# EasyEDA Pro project ProProject_ExtBoard-002_2024-05-18.epro, schematic Schematic-ExtBoard-002

## Sheets
1 USB: Create Date: 2024-04-20; Page Name: USB; Project Name: ExtBoard-002; Schematic Name: Schematic-ExtBoard-002; Update Date: 2024-04-20; Company: 嘉立创EDA; Page Size: A4; Version: V1.0
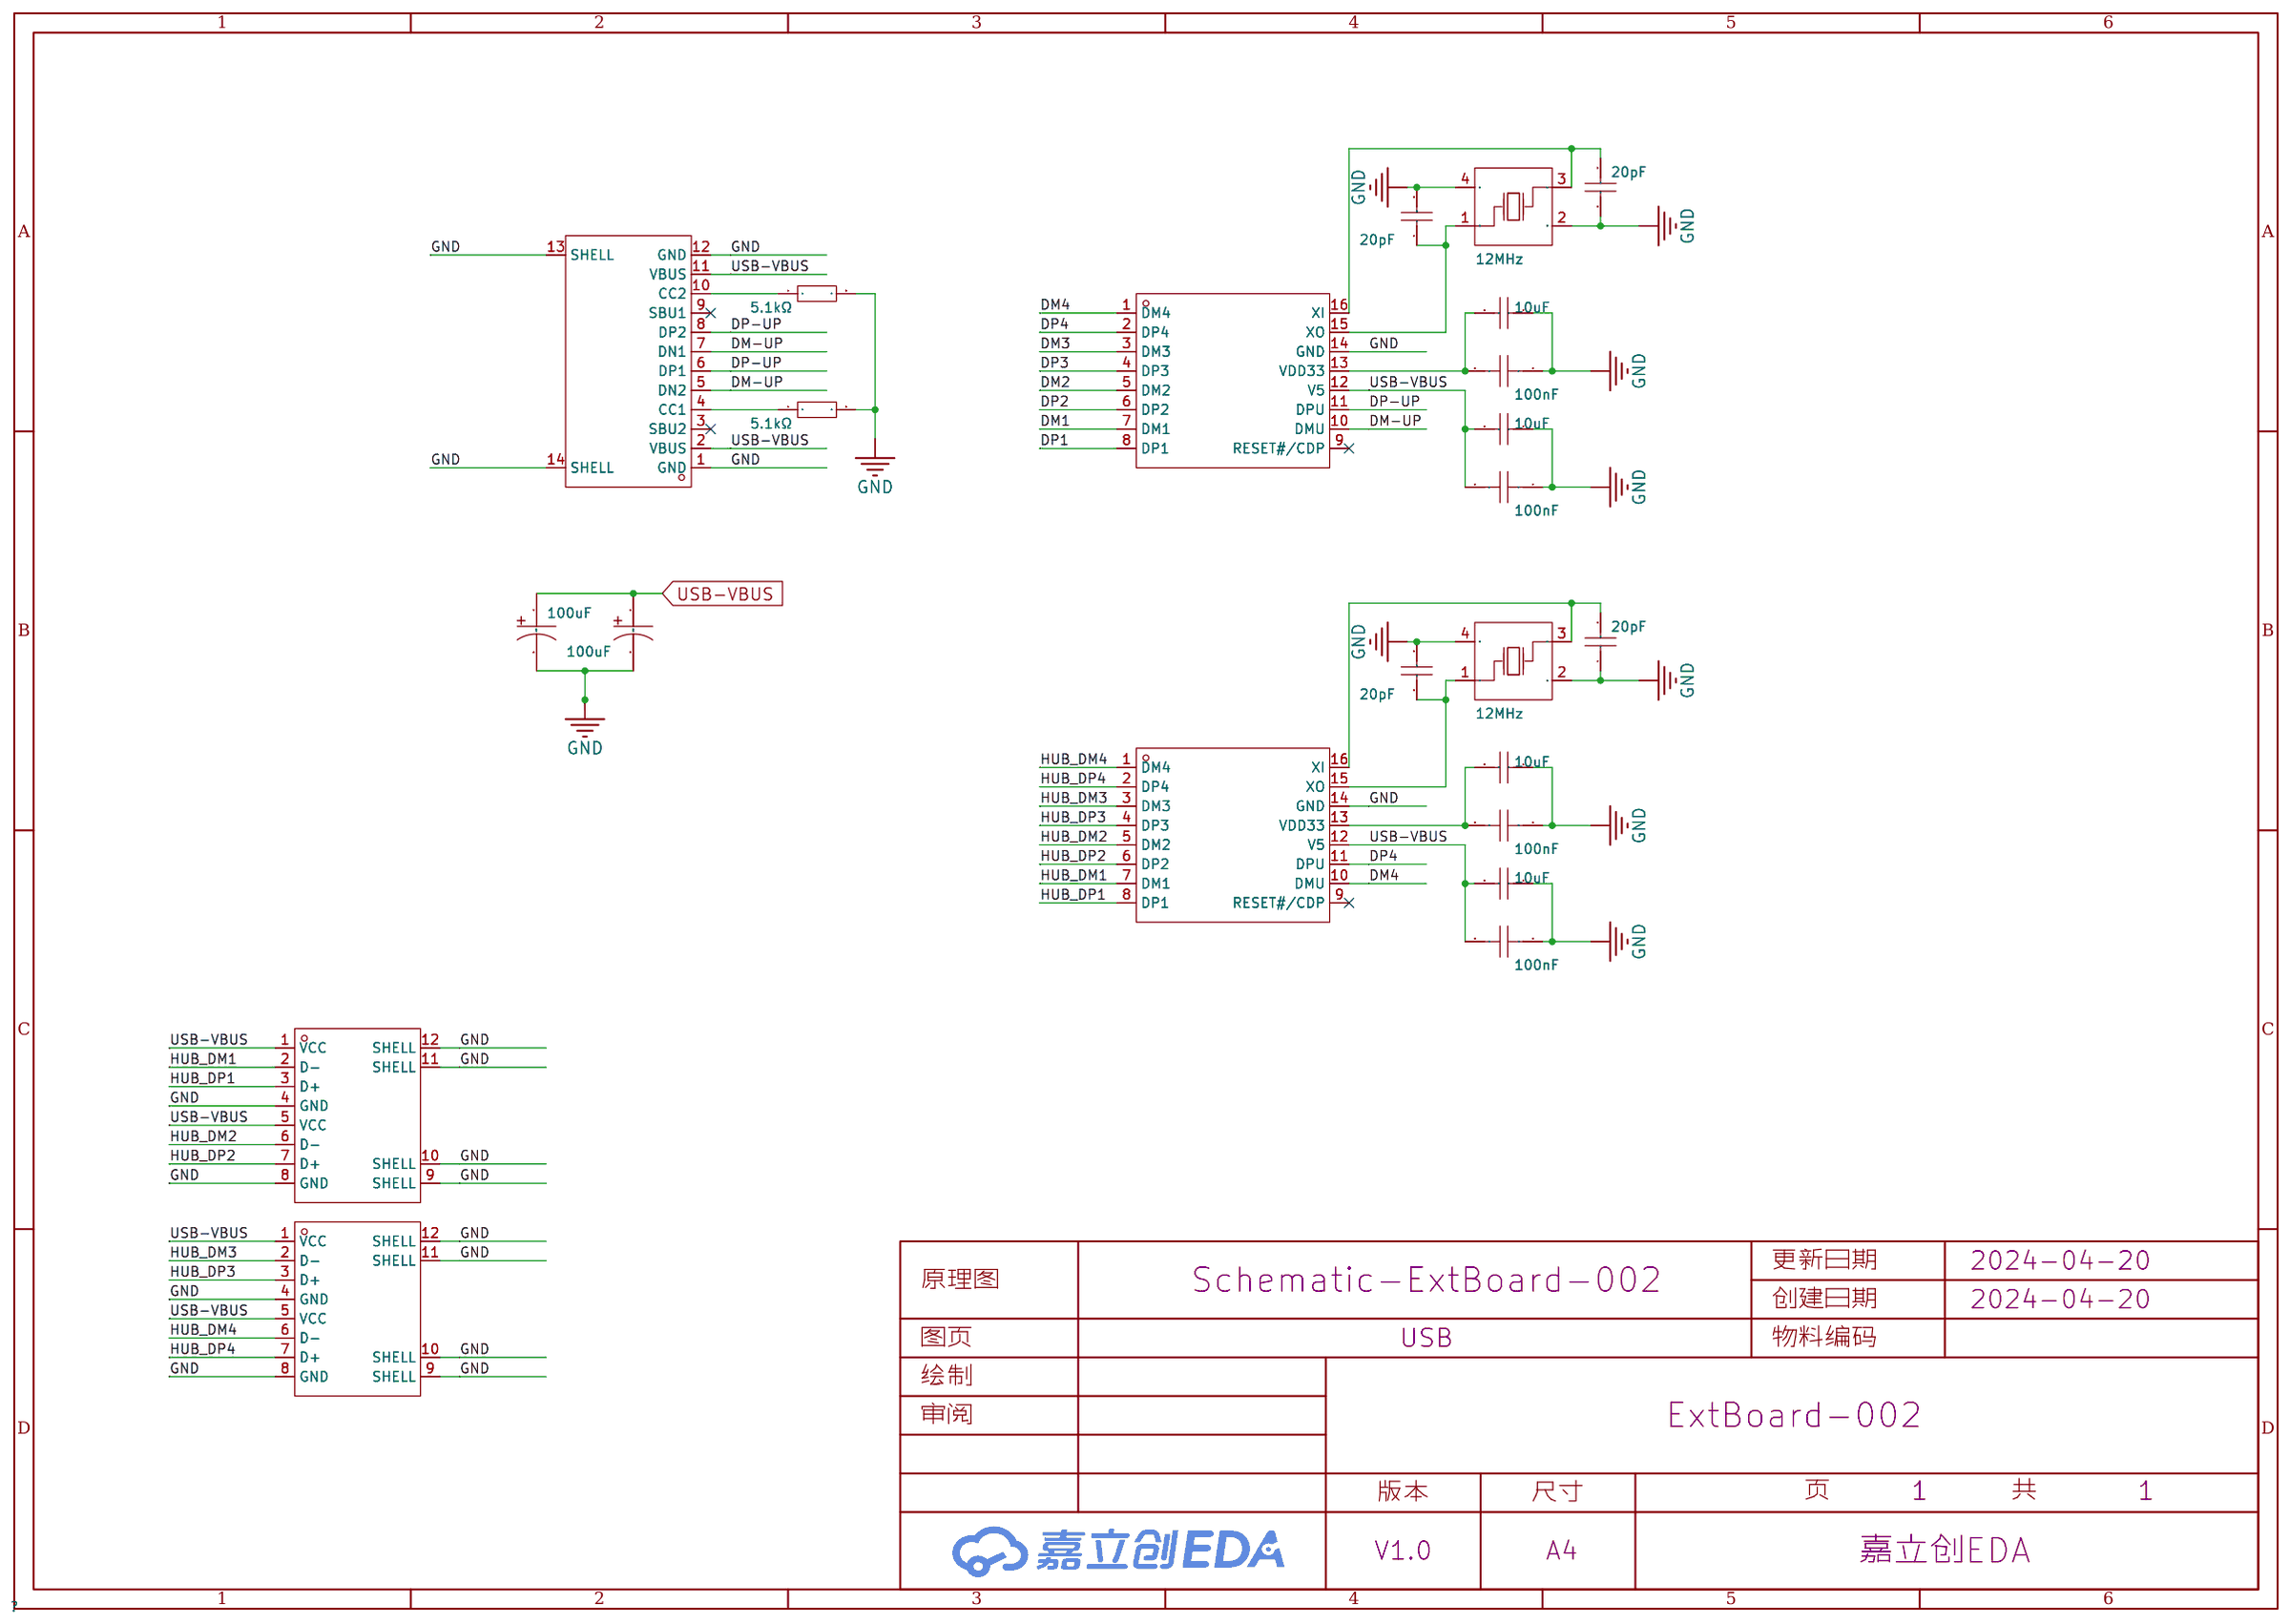
[diagram p0: USB]
2 Power: Page Name: Power
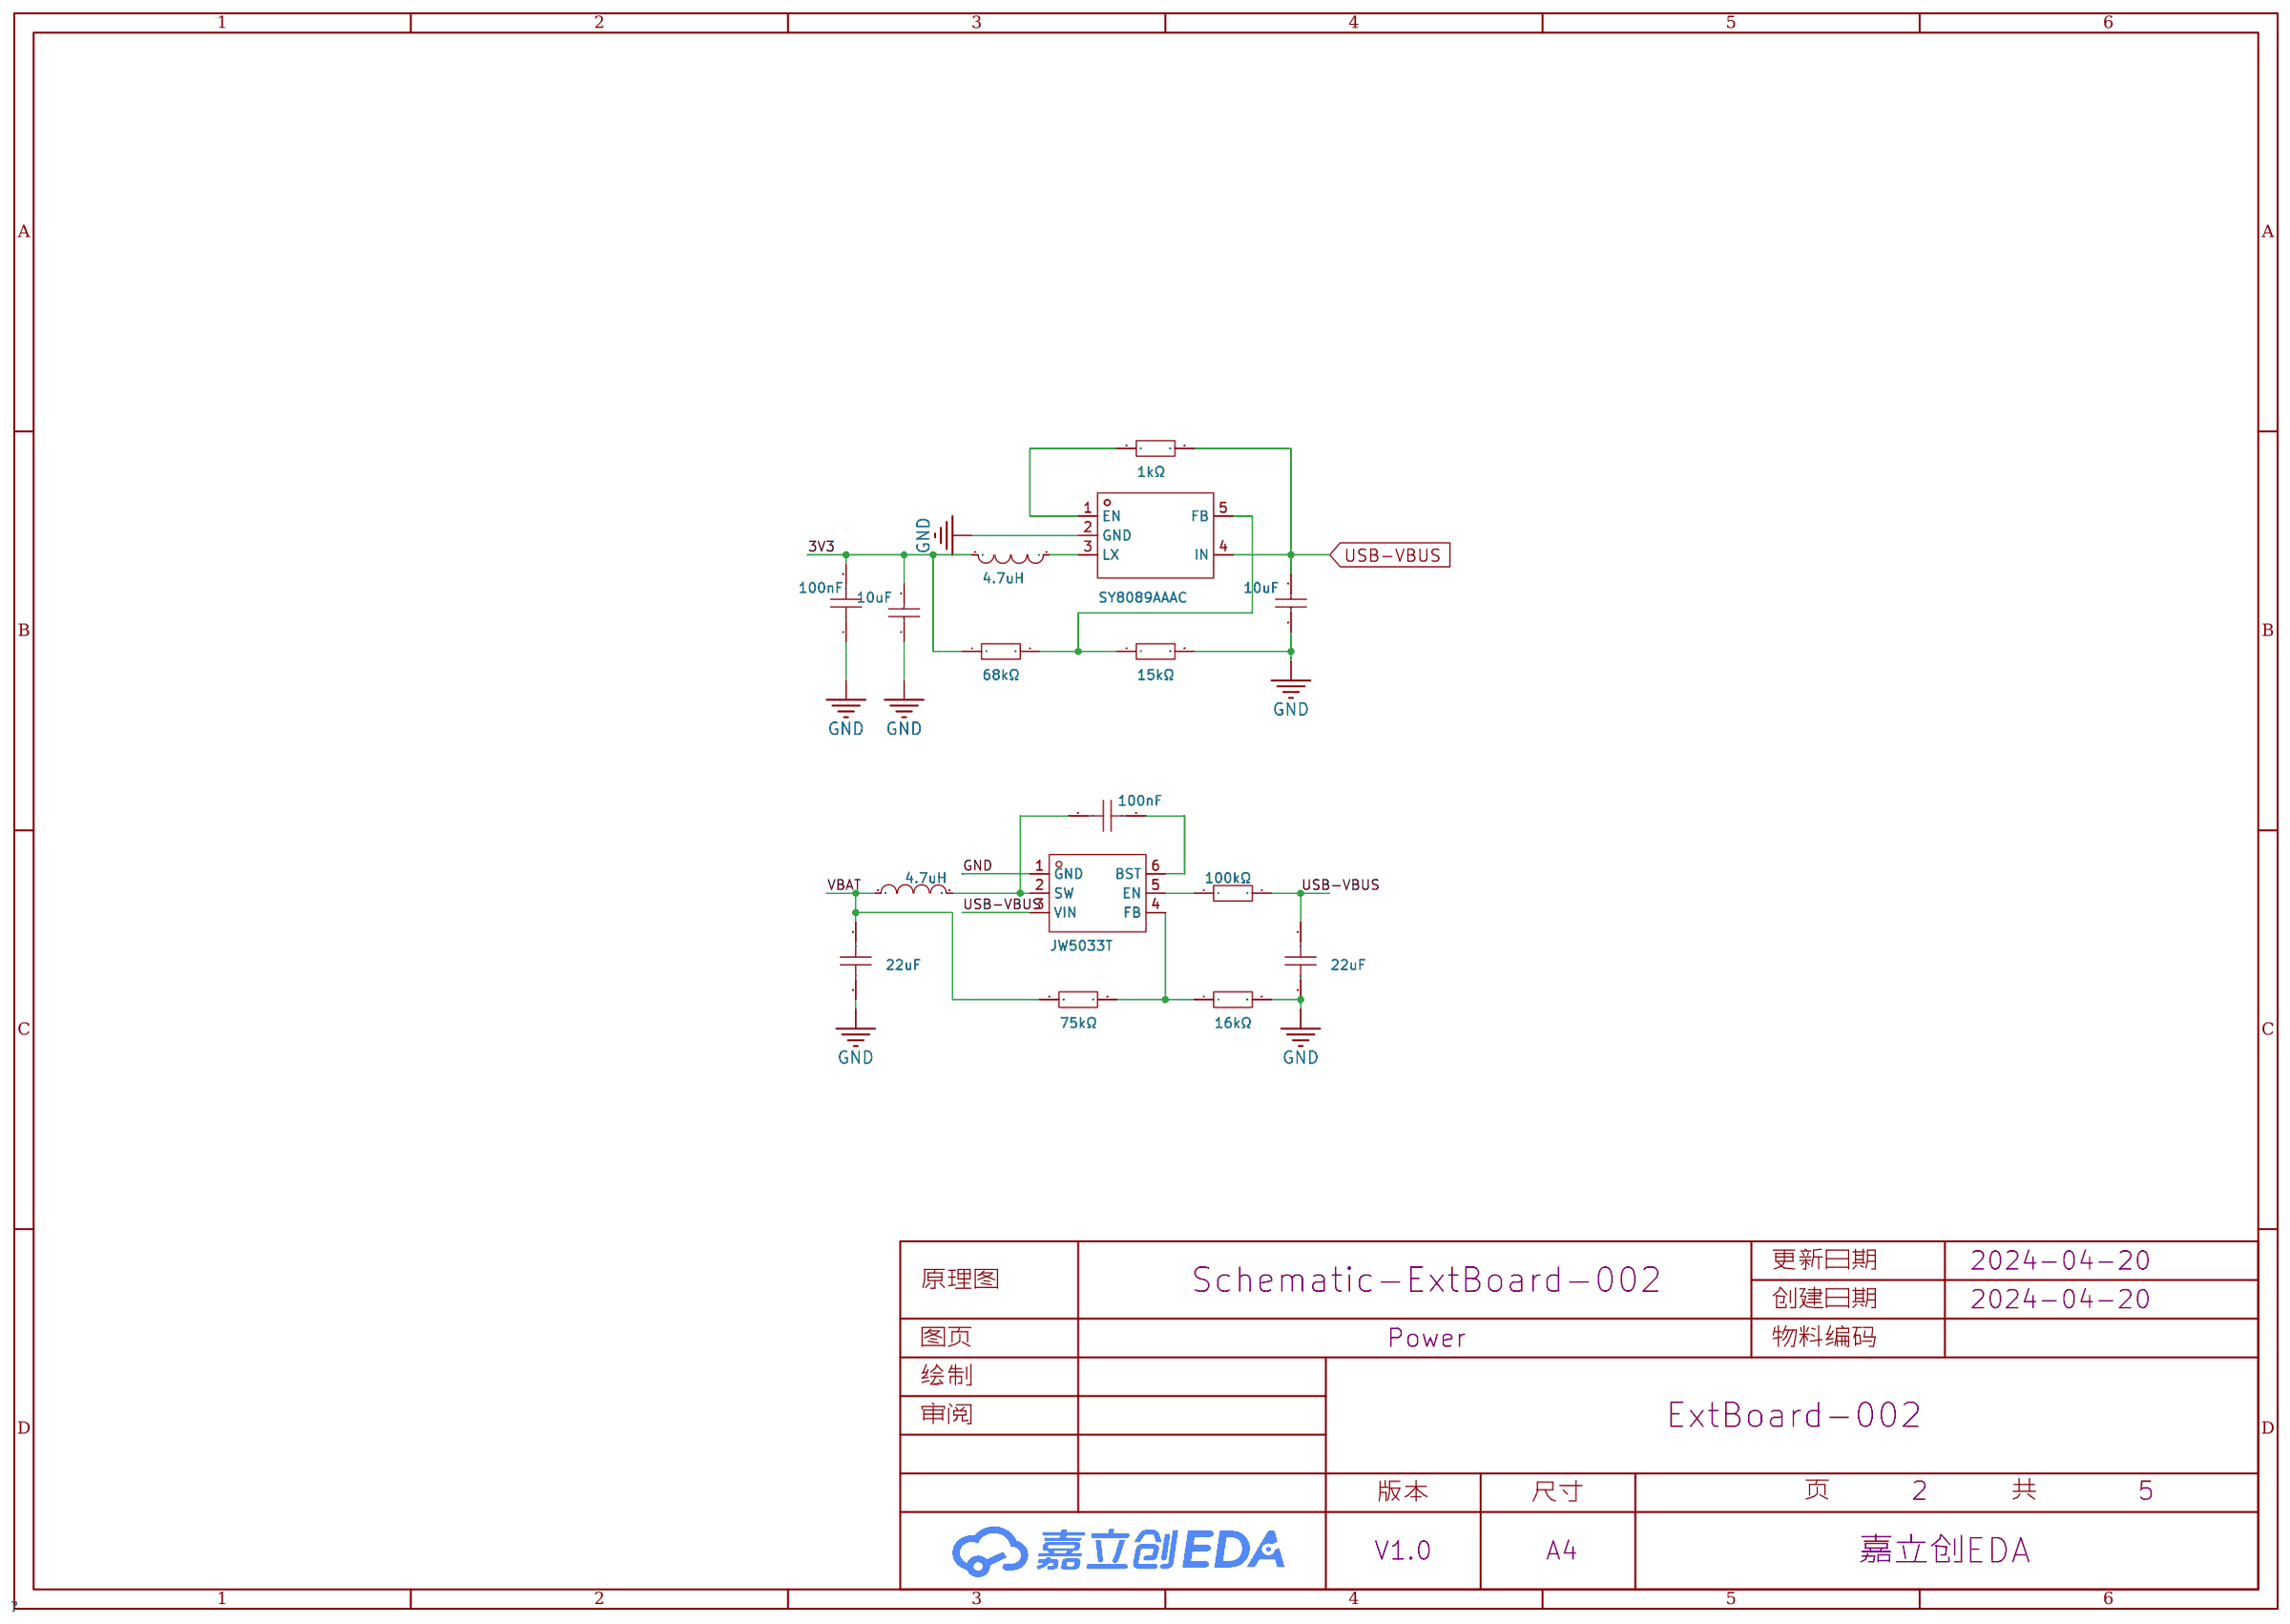
[diagram p1: Power]
3 Air780EG: Page Name: Air780EG; Update Date: 2024-05-10
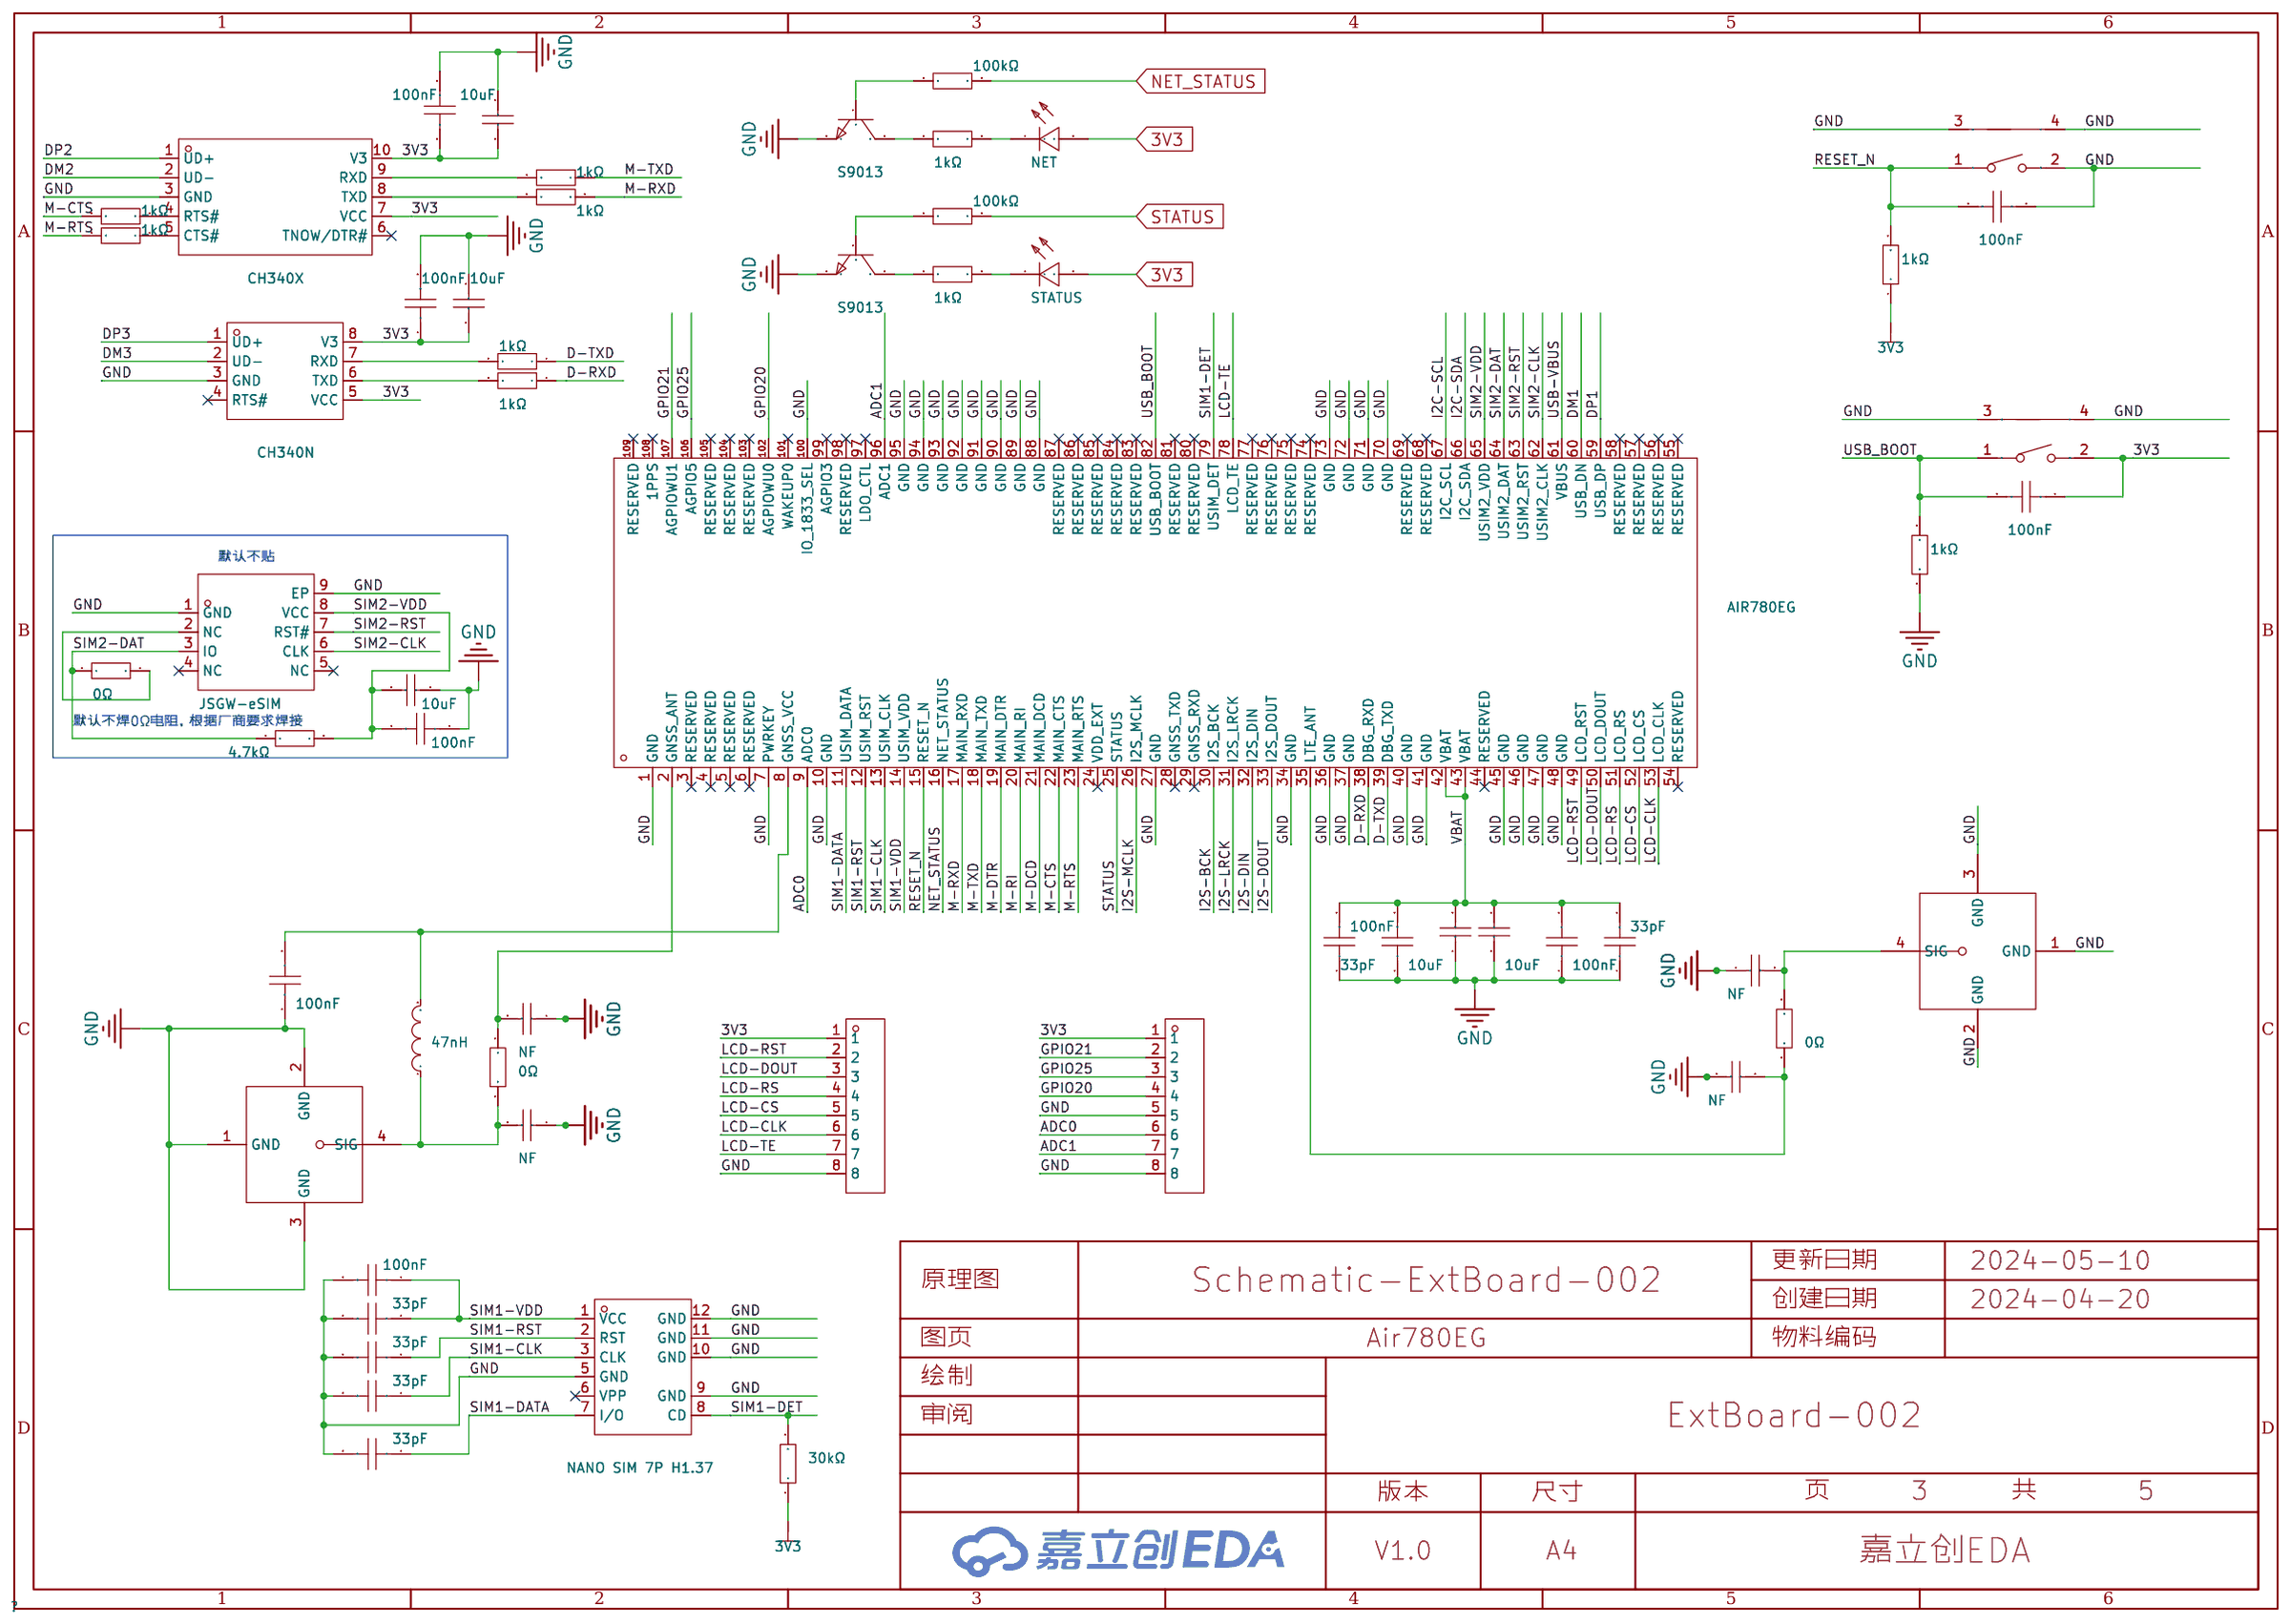
[diagram p2: Air780EG]
4 Audio: Page Name: Audio
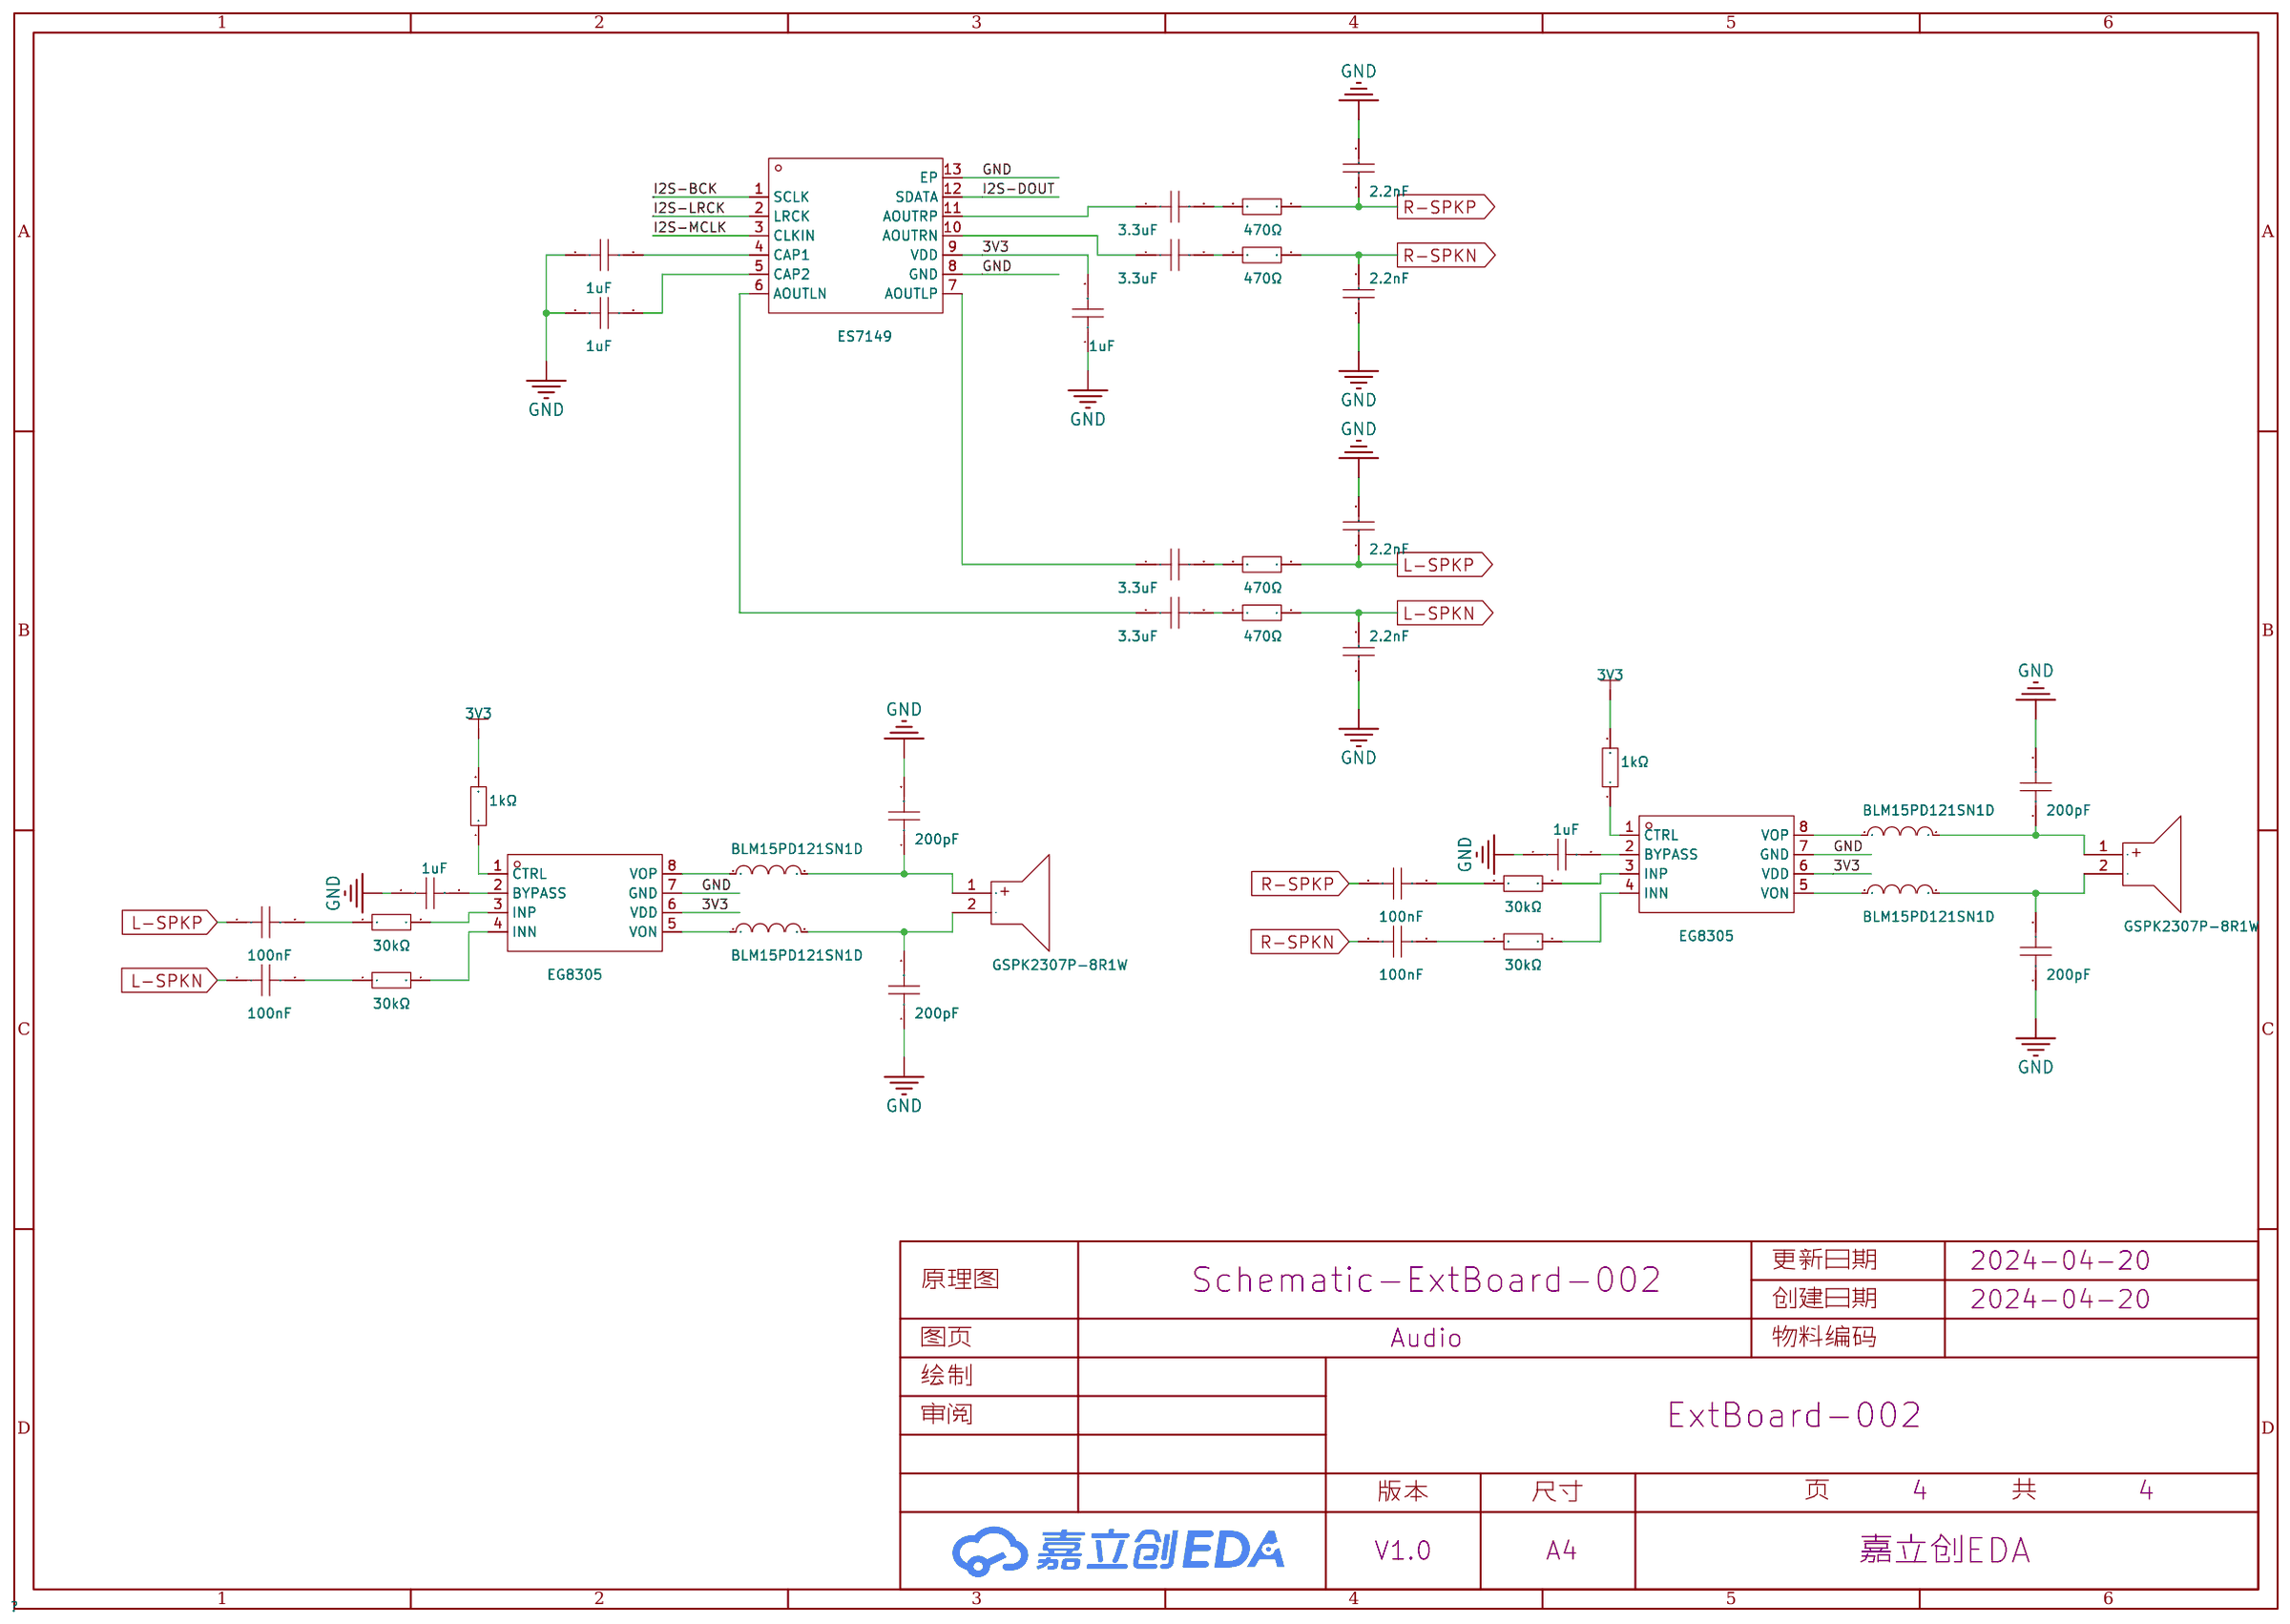
[diagram p3: Audio]
5 AHT20: Create Date: 2024-04-21; Page Name: AHT20; Update Date: 2024-04-21
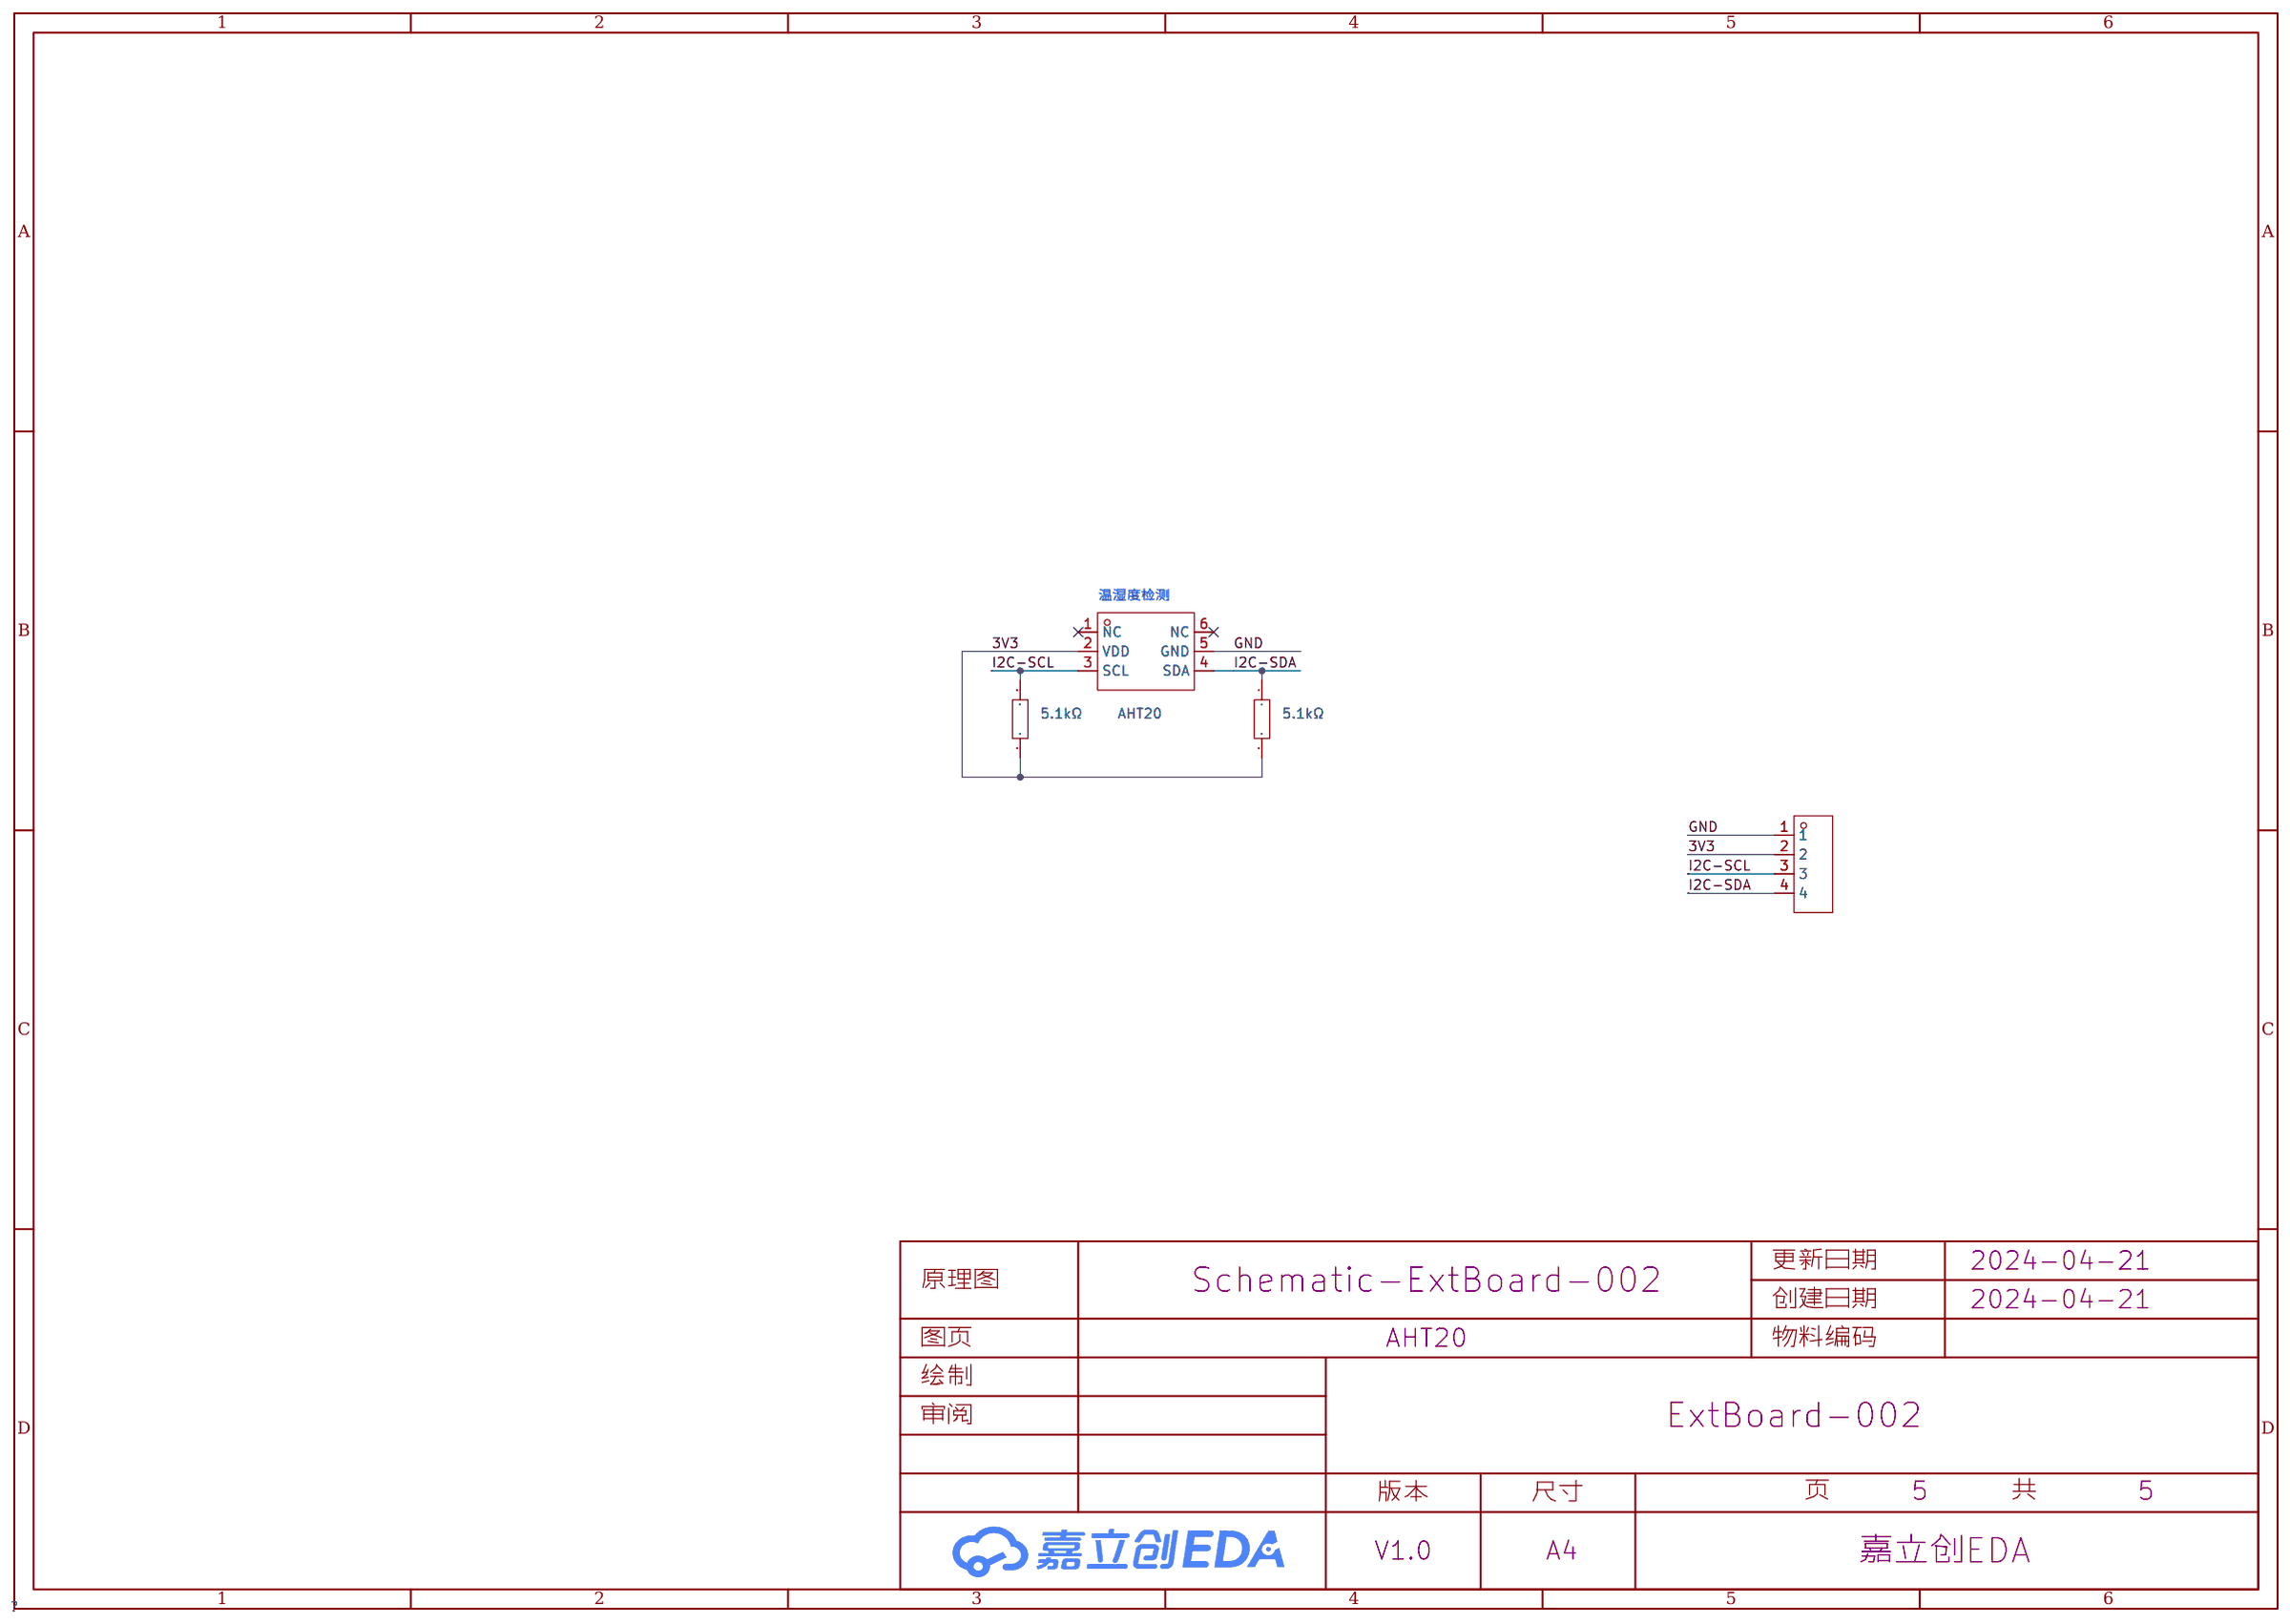
[diagram p4: AHT20]

## Parts
sheet AHT20
CN1  HC-ZH1.5-4A  [CONN-TH_4P-P1.50_HCTL_HC-ZH1.5-4A]
R30  5.1kΩ  [R0402]
R31  5.1kΩ  [R0402]
U12  AHT20  [SENSOR-SMD_L3.0-W3.0-P1.00-BR]
sheet Air780EG
C21  100nF  [C0402]
C22  10uF  [C0402]
C23  100nF  [C0402]
C24  100nF  [C0402]
C25  33pF  [C0402]
C26  100nF  [C0402]
C27  10uF  [C0402]
C28  10uF  [C0402]
C29  100nF  [C0402]
C30  33pF  [C0402]
C31  NF  [C0402]
C32  NF  [C0402]
C33  NF  [C0402]
C34  NF  [C0402]
C35  10uF  [C0402]
C36  100nF  [C0402]
C37  10uF  [C0402]
C38  100nF  [C0402]
C64  33pF  [C0402]
C65  33pF  [C0402]
C66  33pF  [C0402]
C67  33pF  [C0402]
C68  100nF  [C0402]
C69  100nF  [C0402]
CN2  HC-PHD-2*4A  [CONN-TH_8P-HC-PHD-2-4A]
CN3  HC-PHD-2*4A  [CONN-TH_8P-HC-PHD-2-4A]
L7  47nH  [L0402]
LED1  NET  [LED0603-RD_RED]
LED2  STATUS  [LED0603-RD_RED]
Q1  S9013  [SOT-23-3_L2.9-W1.3-P1.90-LS2.4-BR]
Q2  S9013  [SOT-23-3_L2.9-W1.3-P1.90-LS2.4-BR]
R9  100kΩ  [R0402]
R10  1kΩ  [R0402]
R11  100kΩ  [R0402]
R12  1kΩ  [R0402]
R13  1kΩ  [R0402]
R14  1kΩ  [R0402]
R15  0Ω  [R0402]
R16  0Ω  [R0402]
R17  0Ω  [R0402]
R18  4.7kΩ  [R0402]
R29  30kΩ  [R0402]
R32  1kΩ  [R0402]
R33  1kΩ  [R0402]
R34  1kΩ  [R0402]
R35  1kΩ  [R0402]
R36  1kΩ  [R0402]
R37  1kΩ  [R0402]
RF1  KH-IPEX-K501-29  [ANT-SMD_KH-IPEX-K501-29]
RF2  KH-IPEX-K501-29  [ANT-SMD_KH-IPEX-K501-29]
SIM1  NANO SIM 7P H1.37  [SIM-SMD_NANO-SIM-7P-H1.37]
SW1  TS665ZJ  [SW-TH_TS665ZJ]
SW2  TS665ZJ  [SW-TH_TS665ZJ]
U4  CH340X  [MSOP-10_L3.0-W3.0-P0.50-LS5.0-BL]
U6  AIR780EG  [LCC-109_L17.7-W15.8-P1.10_EC800M-CN]
U7  CH340N  [SOP-8_L4.9-W3.9-P1.27-LS6.0-BL]
U8  JSGW-eSIM  [TDFN-8_L6.0-W5.0-P1.27-TL-EP]
sheet Audio
C39  1uF  [C0402]
C40  1uF  [C0402]
C41  1uF  [C0402]
C42  3.3uF  [C0402]
C43  3.3uF  [C0402]
C44  2.2nF  [C0402]
C45  2.2nF  [C0402]
C46  3.3uF  [C0402]
C47  3.3uF  [C0402]
C48  2.2nF  [C0402]
C49  2.2nF  [C0402]
C50  1uF  [C0402]
C51  100nF  [C0402]
C52  100nF  [C0402]
C55  1uF  [C0402]
C56  100nF  [C0402]
C57  100nF  [C0402]
C60  200pF  [C0402]
C61  200pF  [C0402]
C62  200pF  [C0402]
C63  200pF  [C0402]
L3  BLM15PD121SN1D  [L0402]
L4  BLM15PD121SN1D  [L0402]
L5  BLM15PD121SN1D  [L0402]
L6  BLM15PD121SN1D  [L0402]
R19  470Ω  [R0402]
R20  470Ω  [R0402]
R21  470Ω  [R0402]
R22  470Ω  [R0402]
R23  1kΩ  [R0402]
R24  30kΩ  [R0402]
R25  30kΩ  [R0402]
R26  1kΩ  [R0402]
R27  30kΩ  [R0402]
R28  30kΩ  [R0402]
SPK1  GSPK2307P-8R1W  [SPK-TH_BD23.0-P10.00-D0.8-L-RD]
SPK2  GSPK2307P-8R1W  [SPK-TH_BD23.0-P10.00-D0.8-L-RD]
U9  ES7149  [QFN-12_L2.5-W2.5-P0.50-BL-EP]
U10  EG8305  [SOIC-8_L5.0-W4.0-P1.27-LS6.0-BL]
U11  EG8305  [SOIC-8_L5.0-W4.0-P1.27-LS6.0-BL]
sheet Power
C15  100nF  [C0402]
C16  10uF  [C0402]
C17  10uF  [C0402]
C18  100nF  [C0402]
C19  22uF  [C0603]
C20  22uF  [C0603]
L1  4.7uH  [IND-SMD_L4.0-W4.0]
L2  4.7uH  [IND-SMD_L4.0-W4.0]
R3  1kΩ  [R0402]
R4  68kΩ  [R0402]
R5  15kΩ  [R0402]
R6  100kΩ  [R0402]
R7  75kΩ  [R0402]
R8  16kΩ  [R0402]
U3  SY8089AAAC  [SOT-23-5_L3.0-W1.7-P0.95-LS2.8-BR]
U5  JW5033T  [TSOT-23-6_L2.9-W1.6-P0.95-LS2.8-BR]
sheet USB
C1  20pF  [C0402]
C2  20pF  [C0402]
C3  10uF  [C0402]
C4  100nF  [C0402]
C5  10uF  [C0402]
C6  100nF  [C0402]
C7  100uF  [CAP-SMD_BD6.3-L6.6-W6.6-FD]
C8  100uF  [CAP-SMD_BD6.3-L6.6-W6.6-FD]
C9  20pF  [C0402]
C10  20pF  [C0402]
C11  10uF  [C0402]
C12  100nF  [C0402]
C13  10uF  [C0402]
C14  100nF  [C0402]
R1  5.1kΩ  [R0402]
R2  5.1kΩ  [R0402]
U1  CH334R  [QSOP-16_L4.9-W3.9-P0.64-LS6.0-BL]
U2  CH334R  [QSOP-16_L4.9-W3.9-P0.64-LS6.0-BL]
USB1  TYPE-C 16PIN 2MD(073)  [USB-C-SMD_TYPE-C-6PIN-2MD-073]
USB2  AF SS-JB17.6  [USB-A-TH_AF-SS-JB17.6]
USB3  AF SS-JB17.6  [USB-A-TH_AF-SS-JB17.6]
X1  12MHz  [OSC-SMD_4P-L3.2-W2.5-BL]
X2  12MHz  [OSC-SMD_4P-L3.2-W2.5-BL]

## Library data of the parts
CN1 = HC-ZH1.5-4A: 插针结构:1x4P;间距:1.5mm;安装方式:直插;参考系列:ZH;总PIN数:4P;排数:1;每排PIN数:4;行距:-;额定电流:1A;触头材质:黄铜;触头镀层:锡;工作温度范围:-25℃~+85℃;; LCSC Part Name: 1x4P 间距:1.5mm 直插 系列:ZH; Supplier Part: C2845552; Manufacturer: HCTL(华灿天禄); Supplier Footprint: 插件,P=1.5mm; JLCPCB Part Class: 扩展库; Datasheet: https://atta.szlcsc.com/upload/public/pdf/source/20230711/891FEA77A098E3B44CC72703EA57A8B8.pdf; Supplier: LCSC; Pins Structure: 1x4P; Pitch: 1.5mm; Mounting Style: 直插; Reference Series: ZH; Number of Pins: 4P; Number of Rows: 1; Number of PINs Per Row: 4; Current Rating (Max): 1A; Contact Material: 黄铜; Contact Plating: 锡; Operating Temperature Range: -25℃~+85℃
R1 R2 R30 R31 = 0402WGF5101TCE: 阻值:5.1kΩ;精度:±1%;功率:62.5mW;温度系数:±100ppm/℃;电阻类型:厚膜电阻;; LCSC Part Name: 5.1kΩ ±1% 62.5mW 厚膜电阻; Supplier Part: C25905; Manufacturer: UNI-ROYAL(厚声); Supplier Footprint: 0402; JLCPCB Part Class: Basic Part; Datasheet: https://atta.szlcsc.com/upload/public/pdf/source/20200306/C422600_1E6D84923E4A46A82E41ADD87F860B5C.pdf; Supplier: LCSC; Tolerance: ±1%; Power(Watts): 62.5mW; Overload Voltage (Max): 50V; Temperature Coefficient: ±100ppm/℃; Type: 厚膜电阻; Operating Temperature Range: -55℃~+155℃
U12 = AHT20: Supplier Part: C2757850; Manufacturer: 广州奥松; Supplier Footprint: SMD; JLCPCB Part Class: 扩展库; Datasheet: https://atta.szlcsc.com/upload/public/pdf/source/20231023/00557B34ED120268320A4810FF8DED4D.pdf; Supplier: LCSC
C4 C6 C12 C14 C15 C18 C21 C23 C24 C26 C29 C36 C38 C51 C52 C56 C57 C68 C69 = CC0402KRX7R7BB104: 容值:100nF;精度:±10%;额定电压:16V;材质(温度系数):X7R;; LCSC Part Name: 100nF ±10% 16V; Supplier Part: C60474; Manufacturer: YAGEO(国巨); Supplier Footprint: 0402; JLCPCB Part Class: Extended Part; Datasheet: https://atta.szlcsc.com/upload/public/pdf/source/20211223/9278FD768280B81DDBEF48FA36411A03.pdf; Supplier: LCSC; Tolerance: ±10%; Voltage Rated: 16V; Temperature Coefficient: X7R
C3 C5 C11 C13 C16 C17 C22 C27 C28 C35 C37 = CL05A106MQ5NUNC: 容值:10uF;精度:±20%;额定电压:6.3V;材质(温度系数):X5R;; LCSC Part Name: 10uF ±20% 6.3V; Supplier Part: C15525; Manufacturer: SAMSUNG(三星); Supplier Footprint: 0402; JLCPCB Part Class: 基础库; Datasheet: https://atta.szlcsc.com/upload/public/pdf/source/20220823/2B02EE04F8F211D38A52DCB16EB6BEBA.pdf; Supplier: LCSC; Tolerance: ±20%; Voltage Rated: 6.3V; Temperature Coefficient: X5R
C25 C30 C64-C67 = C1005C0G1H330J050BA: 容值:33pF;精度:±5%;额定电压:50V;材质(温度系数):C0G;; LCSC Part Name: 33pF ±5% 50V; Supplier Part: C3847043; Manufacturer: TDK; Supplier Footprint: 0402; JLCPCB Part Class: 扩展库; Supplier: LCSC; Tolerance: ±5%; Voltage Rated: 50V; Temperature Coefficient: C0G
C31-C34 = 0402CG1R0C500NT: 容值:1pF;额定电压:50V;材质(温度系数):C0G;; LCSC Part Name: 1pF 50V ±0.25pF; Supplier Part: C1550; Manufacturer: FH(风华); Supplier Footprint: 0402; JLCPCB Part Class: 扩展库; Datasheet: https://atta.szlcsc.com/upload/public/pdf/source/20200305/C486355_26A10D38EF8C2A5C37091D0039909270.pdf; Supplier: LCSC; Voltage Rated: 50V; Temperature Coefficient: C0G
CN2 CN3 = HC-PHD-2*4A_C2845615: 插针结构:2x4P;间距:2mm;安装方式:直插;参考系列:PHD;总PIN数:8P;排数:2;每排PIN数:4;行距:2mm;额定电流:3A;触头材质:黄铜;触头镀层:锡;工作温度范围:-25℃~+85℃;; LCSC Part Name: 2x4P 间距:2mm 直插 系列:PHD; Supplier Part: C2845615; Manufacturer: HCTL(华灿天禄); Supplier Footprint: 插件,P=2mm; JLCPCB Part Class: 扩展库; Datasheet: https://atta.szlcsc.com/upload/public/pdf/source/20230711/213B911570049296A4498848D3074BCF.pdf; Supplier: LCSC; Pins Structure: 2x4P; Pitch: 2mm; Mounting Style: 直插; Reference Series: PHD; Number of Pins: 8P; Number of Rows: 2; Number of PINs Per Row: 4; Row Spacing: 2mm; Current Rating (Max): 3A; Contact Material: 黄铜; Contact Plating: 锡; Operating Temperature Range: -25℃~+85℃
L7 = LQG15HN47NJ02D: 电感值:47nH;精度:±5%;额定电流:250mA;饱和电流(Isat):-;直流电阻(DCR):1.15Ω;; LCSC Part Name: 47nH ±5%; Supplier Part: C97988; Manufacturer: muRata(村田); Supplier Footprint: 0402; JLCPCB Part Class: 扩展库; Datasheet: https://atta.szlcsc.com/upload/public/pdf/source/20170523/1495533989819.pdf; Supplier: LCSC; Tolerance: ±5%; Rated Current: 250mA; DC Resistance (DCR): 1.15Ω; Q @ Freq: 8@100MHz; Frequency - Self Resonant: 1GHz
LED1 LED2 = NCD0603R1_C84263: 发光颜色:红色;功率:65mW;透镜颜色:无色透明;主波长:615nm~630nm;发光强度:80mcd~220mcd;发光角度:130°;工作温度:-30℃~+85℃;; LCSC Part Name: 红灯 0603红灯   正贴; Supplier Part: C84263; Manufacturer: 国星光电; Manufacturer Part: NCD0603R1; Supplier Footprint: 0603; JLCPCB Part Class: Extended Part; Datasheet: https://atta.szlcsc.com/upload/public/pdf/source/20200820/C84263_DABC6A75E58F576973B407FDBA283D60.pdf; Supplier: LCSC; Emitted Color: 红色; Forward Voltage (VF): 1.6V~2.6V; Forward Current: 20mA; Power Dissipation: 65mW; Lens Color: 无色透明; Dominant Wavelength: 615nm~630nm; Luminous Intensity: 80mcd~220mcd; Viewing Angle: 130°; Operating Temperature: -30℃~+85℃
Q1 Q2 = S9013_C2891800: 晶体管类型:NPN;集电极电流(Ic):500mA;集射极击穿电压(Vceo):25V;功率(Pd):300mW;; LCSC Part Name: NPN 电流:500mA 耐压:25V; Supplier Part: C2891800; Manufacturer: YONGYUTAI(永裕泰); Supplier Footprint: SOT-23; JLCPCB Part Class: 扩展库; Datasheet: https://atta.szlcsc.com/upload/public/pdf/source/20210901/D431C9F57CC026183A9A17AA4C687C10.pdf; Supplier: LCSC; Transistor Type: NPN; Collector Current (Ic): 500mA; Collector-Emitter Breakdown Voltage (Vceo): 25V; Power Dissipation (Pd): 300mW; Collector Cut-Off Current (Icbo): 1uA; Collector-Emitter Saturation Voltage (VCE(sat)@Ic,Ib): 500mV@500mA,50mA
R6 R9 R11 = RC0402FR-07100KL: 电阻类型:厚膜电阻;阻值:100kΩ;精度:±1%;功率:62.5mW;; LCSC Part Name: 100kΩ ±1% 62.5mW; Supplier Part: C60491; Manufacturer: YAGEO(国巨); Supplier Footprint: 0402; JLCPCB Part Class: Extended Part; Datasheet: https://atta.szlcsc.com/upload/public/pdf/source/20170518/1495086055123.pdf; Supplier: LCSC; Type: 厚膜电阻; Tolerance: ±1%; Power(Watts): 62.5mW; Temperature Coefficient: ±100ppm/℃; Overload Voltage (Max): 50V; Operating Temperature Range: -55℃~+155℃
R3 R10 R12-R14 R23 R26 R32-R37 = 0402WGF1001TCE: 阻值:1kΩ;精度:±1%;功率:62.5mW;温度系数:±100ppm/℃;电阻类型:厚膜电阻;; LCSC Part Name: 1kΩ ±1% 62.5mW 厚膜电阻; Supplier Part: C11702; Manufacturer: UNI-ROYAL(厚声); Supplier Footprint: 0402; JLCPCB Part Class: 基础库; Datasheet: https://atta.szlcsc.com/upload/public/pdf/source/20200306/C422600_1E6D84923E4A46A82E41ADD87F860B5C.pdf; Supplier: LCSC; Tolerance: ±1%; Power(Watts): 62.5mW; Overload Voltage (Max): 50V; Temperature Coefficient: ±100ppm/℃; Type: 厚膜电阻; Operating Temperature Range: -55℃~+155℃
R15 R16 = 0402WGF0000TCE: 阻值:0Ω;精度:±1%;功率:62.5mW;温度系数:±800ppm/℃;电阻类型:厚膜电阻;; LCSC Part Name: 0Ω ±1% 62.5mW 厚膜电阻; Supplier Part: C17168; Manufacturer: UNI-ROYAL(厚声); Supplier Footprint: 0402; JLCPCB Part Class: Basic Part; Datasheet: https://atta.szlcsc.com/upload/public/pdf/source/20200306/C422600_1E6D84923E4A46A82E41ADD87F860B5C.pdf; Supplier: LCSC; Tolerance: ±1%; Power(Watts): 62.5mW; Overload Voltage (Max): 50V; Temperature Coefficient: ±800ppm/℃; Type: 厚膜电阻; Operating Temperature Range: -55℃~+155℃
R17 = RC0402JR-070RL: 电阻类型:厚膜电阻;阻值:0Ω;精度:±5%;功率:62.5mW;最大工作电压:50V;温度系数:-;; LCSC Part Name: 厚膜电阻 0Ω ±5% 62.5mW; Supplier Part: C60485; Manufacturer: YAGEO(国巨); Supplier Footprint: 0402; JLCPCB Part Class: 扩展库; Datasheet: https://atta.szlcsc.com/upload/public/pdf/source/20170428/1493376821999.pdf; Supplier: LCSC; Type: 厚膜电阻; Tolerance: ±5%; Power(Watts): 62.5mW; Overload Voltage (Max): 50V; Operating Temperature Range: -55℃~+155℃
R18 = RC0402FR-074K7L: 电阻类型:厚膜电阻;阻值:4.7kΩ;精度:±1%;功率:62.5mW;最大工作电压:50V;温度系数:±100ppm/℃;; LCSC Part Name: 厚膜电阻 4.7kΩ ±1% 62.5mW; Supplier Part: C105871; Manufacturer: YAGEO(国巨); Supplier Footprint: 0402; JLCPCB Part Class: 扩展库; Datasheet: https://atta.szlcsc.com/upload/public/pdf/source/20180821/C275644_0D56F95EFF785E7D9A1FEF436B37DA78.pdf; Supplier: LCSC; Type: 厚膜电阻; Tolerance: ±1%; Power(Watts): 62.5mW; Overload Voltage (Max): 50V; Temperature Coefficient: ±100ppm/℃; Operating Temperature Range: -55℃~+155℃
R24 R25 R27-R29 = RC0402FR-0730KL: 电阻类型:厚膜电阻;阻值:30kΩ;精度:±1%;功率:62.5mW;最大工作电压:50V;温度系数:±100ppm/℃;; LCSC Part Name: 厚膜电阻 30kΩ ±1% 62.5mW; Supplier Part: C138008; Manufacturer: YAGEO(国巨); Supplier Footprint: 0402; JLCPCB Part Class: 扩展库; Datasheet: https://atta.szlcsc.com/upload/public/pdf/source/20181009/C309620_DA5935B6E1D48212CB7A533FE518B3C2.pdf; Supplier: LCSC; Type: 厚膜电阻; Tolerance: ±1%; Power(Watts): 62.5mW; Overload Voltage (Max): 50V; Temperature Coefficient: ±100ppm/℃; Operating Temperature Range: -55℃~+155℃
RF1 RF2 = KH-IPEX-K501-29: 连接器类型:板端;接口类型:内针;频率-最大值:3GHz;接口直径:2mm;射频系列:IPEX;端口数量:1;阻抗:50Ω;样式:-;接口长度/高度:1.25mm;工作温度范围:-40℃~+90℃;; LCSC Part Name: IPEX 内针 1代; Supplier Part: C411563; Manufacturer: kinghelm(金航标); Supplier Footprint: SMD; JLCPCB Part Class: 扩展库; Datasheet: https://atta.szlcsc.com/upload/public/pdf/source/20220620/3534C43453AFDE5147CC743E04DB9A56.pdf; Supplier: LCSC; Connector Type: 板端; Interface Type: 内针; Frequency-Max: 3GHz; Interface Diameter: 2mm; RF Series: IPEX; Number of Ports: 1; Impedance: 50Ω; Interface Length/Height: 1.25mm; Operating Temperature Range: -40℃~+90℃
SIM1 = NANO SIM 7P H1.37: 卡连接方式:自弹式;卡类型:NanoSIM卡;连接器类型:卡座;本体最大高度:1.37mm;触头材质:铜合金;触头镀层:金;工作温度范围:-40℃~+70℃;; LCSC Part Name: 自弹式 NanoSIM卡 卡座; Supplier Part: C7529384; Manufacturer: SHOU HAN(首韩); Supplier Footprint: SMD; JLCPCB Part Class: 扩展库; Datasheet: https://atta.szlcsc.com/upload/public/pdf/source/20230818/0FFC58DEBCCAE2358C5DB79170A6475F.pdf; Supplier: LCSC; Card Connection Mode: 自弹式; Card Type: NanoSIM卡; Connector Type: 卡座; Body Height (Max): 1.37mm; Contact Material: 铜合金; Contact Plating: 金; Operating Temperature Range: -40℃~+70℃
SW1 SW2 = TS665ZJ: 电路结构:单刀单掷;按钮形状:圆形按钮;作用力:250gf;安装方式:卧插;开关长度:6.2mm;开关宽度:6.2mm;开关高度:5mm;带支架:带支架;触点电流:50mA;额定电压(DC):12V;绝缘电阻:100MΩ;机械寿命:5万次;; LCSC Part Name: 6.2*6.2*5mm 卧插 轻触开关; Supplier Part: C557599; Manufacturer: SHOU HAN(首韩); Supplier Footprint: 插件; JLCPCB Part Class: 扩展库; Datasheet: https://atta.szlcsc.com/upload/public/pdf/source/20200519/C557599_C93058E34E1879225DC935A3AAEF7EAA.pdf; Supplier: LCSC; Circuit: 单刀单掷; Actuator Style: 圆形按钮; Operating Force: 250gf; Mounting Style: 卧插; Switch Length: 6.2mm; Switch Width: 6.2mm; Switch Height: 5mm; Strike Gundam: 带支架; Contact Current: 50mA; Voltage Rating (DC): 12V; Insulation Resistance: 100MΩ; Actuator/Cap Color: 黑色; Pin Style: PC引脚; Mechanical Life: 5万次
U4 = CH340X: Supplier Part: C3035748; Manufacturer: WCH(南京沁恒); Supplier Footprint: MSOP-10; JLCPCB Part Class: 扩展库; Datasheet: https://atta.szlcsc.com/upload/public/pdf/source/20230530/6E401E9554E9F5311886CC8B3F89B62E.pdf; Supplier: LCSC
U6 = AIR780EG: LCSC Part Name: AIR780EG_C9900042550; JLCPCB Part Class: 扩展库
U7 = CH340N: LCSC Part Name: USB转串口芯片 CH340; Supplier Part: C2977777; Manufacturer: WCH(南京沁恒); Supplier Footprint: SOP-8; JLCPCB Part Class: 扩展库; Datasheet: https://atta.szlcsc.com/upload/public/pdf/source/20230530/6E401E9554E9F5311886CC8B3F89B62E.pdf; Supplier: LCSC
U8 = JSGW-eSIM: Supplier Part: C9900025086; Supplier Footprint: DFN-8; JLCPCB Part Class: 扩展库; Supplier: LCSC
C39-C41 C50 C55 = CC0402KRX5R6BB105: 容值:1uF;精度:±10%;额定电压:10V;材质(温度系数):X5R;; LCSC Part Name: 1uF ±10% 10V; Supplier Part: C106254; Manufacturer: YAGEO(国巨); Supplier Footprint: 0402; JLCPCB Part Class: 扩展库; Datasheet: https://atta.szlcsc.com/upload/public/pdf/source/20170914/C128857_1505359892143968080.pdf; Supplier: LCSC; Tolerance: ±10%; Voltage Rated: 10V; Temperature Coefficient: X5R
C42 C43 C46 C47 = C1005X5R1A335KTJ00E: 容值:3.3uF;精度:±10%;额定电压:10V;材质(温度系数):X5R;; LCSC Part Name: 3.3uF ±10% 10V; Supplier Part: C695126; Manufacturer: TDK; Supplier Footprint: 0402; JLCPCB Part Class: 扩展库; Datasheet: https://atta.szlcsc.com/upload/public/pdf/source/20191008/C432930_1569A900251E35B50161EFC1E9A1C511.pdf; Supplier: LCSC; Tolerance: ±10%; Voltage Rated: 10V; Temperature Coefficient: X5R
C44 C45 C48 C49 = CC0402KRX7R9BB222: 容值:2.2nF;精度:±10%;额定电压:50V;材质(温度系数):X7R;; LCSC Part Name: 2.2nF ±10% 50V; Supplier Part: C106861; Manufacturer: YAGEO(国巨); Supplier Footprint: 0402; JLCPCB Part Class: 扩展库; Datasheet: https://atta.szlcsc.com/upload/public/pdf/source/20170505/1493957848374.pdf; Supplier: LCSC; Tolerance: ±10%; Voltage Rated: 50V; Temperature Coefficient: X7R
C60-C63 = CC0402JRNPO9BN201: 容值:200pF;精度:±5%;额定电压:50V;材质(温度系数):NP0;; LCSC Part Name: 200pF ±5% 50V; Supplier Part: C325462; Manufacturer: YAGEO(国巨); Supplier Footprint: 0402; JLCPCB Part Class: 扩展库; Datasheet: https://atta.szlcsc.com/upload/public/pdf/source/20181031/C325462_F9BFC3262D8DF0399EC634D7156E46C7.pdf; Supplier: LCSC; Tolerance: ±5%; Voltage Rated: 50V; Temperature Coefficient: NP0
L3-L6 = BLM15PD121SN1D: 标称阻抗@测试频率:120Ω@100MHz;误差:±25%;直流电阻(RDC):90mΩ;; LCSC Part Name: 单路 0402磁珠 阻抗120Ω@100MHz; Supplier Part: C76891; Manufacturer: muRata(村田); Supplier Footprint: 0402; JLCPCB Part Class: 扩展库; Datasheet: https://atta.szlcsc.com/upload/public/pdf/source/20181120/C333978_3E581FB55966932B05020139ABDE8E01.pdf; Supplier: LCSC; Impedance @ Frequency: 120Ω@100MHz; Tolerance: ±25%; DC Resistance: 90mΩ; Current Rating: 1.3A; Circuits: 1
R19-R22 = 0402WGF4700TCE: 电阻类型:厚膜电阻;阻值:470Ω;精度:±1%;功率:62.5mW;最大工作电压:50V;温度系数:±100ppm/℃;; LCSC Part Name: 470Ω ±1% 62.5mW 厚膜电阻; Supplier Part: C25117; Manufacturer: UNI-ROYAL(厚声); Supplier Footprint: 0402; JLCPCB Part Class: 基础库; Datasheet: https://atta.szlcsc.com/upload/public/pdf/source/20200306/C422600_1E6D84923E4A46A82E41ADD87F860B5C.pdf; Supplier: LCSC; Type: 厚膜电阻; Tolerance: ±1%; Power(Watts): 62.5mW; Overload Voltage (Max): 50V; Temperature Coefficient: ±100ppm/℃; Operating Temperature Range: -55℃~+155℃
SPK1 SPK2 = GSPK2307P-8R1W: Supplier Part: C530531; Manufacturer: INGHAi(赢海); JLCPCB Part Class: 扩展库; Datasheet: https://atta.szlcsc.com/upload/public/pdf/source/20200723/C530531_BBB4236C037415C04A54E89A31B50803.pdf; Supplier: LCSC
U9 = ES7149: LCSC Part Name: 音频解码芯片; Supplier Part: C365753; Manufacturer: Everest-semi(顺芯); Supplier Footprint: QFN-12-EP(2.5x2.5); JLCPCB Part Class: 扩展库; Datasheet: https://atta.szlcsc.com/upload/public/pdf/source/20190124/C365753_99275FC6EC83768AC36DCAC443F705E7.pdf; Supplier: LCSC
U10 U11 = EG8305: 功放类型:D类功放;扬声器通道数:单声道;输出功率:3Wx1@4Ω;; LCSC Part Name: 3W单声道D类音频功率放大器; Supplier Part: C266226; Manufacturer: EG(屹晶微); Supplier Footprint: SOP-8; JLCPCB Part Class: 扩展库; Datasheet: https://atta.szlcsc.com/upload/public/pdf/source/20180829/C266226_F8540F5DF826D238E7F35044805C10A9.pdf; Supplier: LCSC; Type of Power Amplifier: D类功放; Speaker Channels: 单声道; Output Power: 3Wx1@4Ω; Supply Voltage: 3V~5.5V
C19 C20 = CL10A226MO7JZNC: 容值:22uF;精度:±20%;额定电压:16V;材质(温度系数):X5R;; LCSC Part Name: 22uF ±20% 16V; Supplier Part: C2762594; Manufacturer: SAMSUNG(三星); Supplier Footprint: 0603; JLCPCB Part Class: Extended Part; Datasheet: https://atta.szlcsc.com/upload/public/pdf/source/20220811/0832C3B1C642040B023B7A6186895861.pdf; Supplier: LCSC; Tolerance: ±20%; Voltage Rated: 16V; Temperature Coefficient: X5R
L1 L2 = SWPA4030S4R7MT: 直流电阻(DCR):78mΩ;精度:±20%;电感值:4.7uH;额定电流:2A;; LCSC Part Name: 4.7uH ±20%; Supplier Part: C57269; Manufacturer: Sunlord(顺络); Supplier Footprint: SMD; JLCPCB Part Class: 扩展库; Datasheet: https://atta.szlcsc.com/upload/public/pdf/source/20161024/1477287957557.pdf; Supplier: LCSC; DC Resistance (DCR): 78mΩ; Tolerance: ±20%; Height: 3mm; Width: 4mm; Rated Current: 2A; Length: 4mm
R4 = 0402WGF6802TCE: 阻值:68kΩ;精度:±1%;功率:62.5mW;温度系数:±100ppm/℃;电阻类型:厚膜电阻;; LCSC Part Name: 68kΩ ±1% 62.5mW 厚膜电阻; Supplier Part: C36871; Manufacturer: UNI-ROYAL(厚声); Supplier Footprint: 0402; JLCPCB Part Class: Basic Part; Datasheet: https://atta.szlcsc.com/upload/public/pdf/source/20200306/C422600_1E6D84923E4A46A82E41ADD87F860B5C.pdf; Supplier: LCSC; Tolerance: ±1%; Power(Watts): 62.5mW; Overload Voltage (Max): 50V; Temperature Coefficient: ±100ppm/℃; Type: 厚膜电阻; Operating Temperature Range: -55℃~+155℃
R5 = 0402WGF1502TCE: 阻值:15kΩ;精度:±1%;功率:62.5mW;温度系数:±100ppm/℃;电阻类型:厚膜电阻;; LCSC Part Name: 15kΩ ±1% 62.5mW 厚膜电阻; Supplier Part: C25756; Manufacturer: UNI-ROYAL(厚声); Supplier Footprint: 0402; JLCPCB Part Class: Basic Part; Datasheet: https://atta.szlcsc.com/upload/public/pdf/source/20200306/C422600_1E6D84923E4A46A82E41ADD87F860B5C.pdf; Supplier: LCSC; Tolerance: ±1%; Power(Watts): 62.5mW; Overload Voltage (Max): 50V; Temperature Coefficient: ±100ppm/℃; Type: 厚膜电阻; Operating Temperature Range: -55℃~+155℃
R7 = AECR0402F75K0K9: 电阻类型:厚膜电阻;阻值:75kΩ;功率:63mW;温度系数:±100ppm/℃;精度:±1%;; LCSC Part Name: 厚膜电阻 75kΩ ±1% 63mW; Supplier Part: C328330; Manufacturer: RESI(开步睿思）; Supplier Footprint: 0402; JLCPCB Part Class: 扩展库; Datasheet: https://atta.szlcsc.com/upload/public/pdf/source/20181212/C352486_55819DC58ECB15BFA3B0F11121E3606D.pdf; Supplier: LCSC; Type: 厚膜电阻; Power(Watts): 63mW; Overload Voltage (Max): 50V; Temperature Coefficient: ±100ppm/℃; Tolerance: ±1%; Operating Temperature Range: -55℃~+155℃
R8 = 0402WGF1602TCE: 阻值:16kΩ;精度:±1%;功率:62.5mW;温度系数:±100ppm/℃;电阻类型:厚膜电阻;; LCSC Part Name: 16kΩ ±1% 62.5mW 厚膜电阻; Supplier Part: C25759; Manufacturer: UNI-ROYAL(厚声); Supplier Footprint: 0402; JLCPCB Part Class: Extended Part; Datasheet: https://atta.szlcsc.com/upload/public/pdf/source/20200306/C422600_1E6D84923E4A46A82E41ADD87F860B5C.pdf; Supplier: LCSC; Tolerance: ±1%; Power(Watts): 62.5mW; Overload Voltage (Max): 50V; Temperature Coefficient: ±100ppm/℃; Type: 厚膜电阻; Operating Temperature Range: -55℃~+155℃
U3 = SY8089AAAC: 功能类型:降压型;同步整流:-;输出通道数:-;拓扑结构:-;输入电压:-;输出电流(最大值):-;开关频率:-;; LCSC Part Name: 降压型; Supplier Part: C78988; Manufacturer: silergy(矽力杰); Supplier Footprint: SOT-23-5; JLCPCB Part Class: 扩展库; Datasheet: https://atta.szlcsc.com/upload/public/pdf/source/20210826/394049C81A2AF57A190C26FDBC282657.pdf; Supplier: LCSC; Function: 降压型
U5 = JW5033T: vin=3.7V-18V; Supplier Part: C253994; Manufacturer: Joulwatt(杰华特); Supplier Footprint: TSOT-23-6; JLCPCB Part Class: 扩展库; Datasheet: https://atta.szlcsc.com/upload/public/pdf/source/20190329/C253994_8F534268923FB247E33270455B9C6303.pdf; Supplier: LCSC
C1 C2 C9 C10 = 0402CG200J500NT: 容值:20pF;精度:±5%;额定电压:50V;材质(温度系数):C0G;; LCSC Part Name: 20pF ±5% 50V; Supplier Part: C1554; Manufacturer: FH(风华); Supplier Footprint: 0402; JLCPCB Part Class: Basic Part; Datasheet: https://atta.szlcsc.com/upload/public/pdf/source/20200305/C486355_26A10D38EF8C2A5C37091D0039909270.pdf; Supplier: LCSC; Tolerance: ±5%; Voltage Rated: 50V; Temperature Coefficient: C0G
C7 C8 = VEZ101M1CTR-0605: 容值:100uF;精度:±20%;额定电压:16V;纹波电流:-;等效串联电阻:-;; LCSC Part Name: 100uF ±20% 16V; Supplier Part: C249766; Manufacturer: lelon(立隆); Supplier Footprint: SMD,D6.3xL5.3mm; JLCPCB Part Class: 扩展库; Datasheet: https://atta.szlcsc.com/upload/public/pdf/source/20181120/C249784_89014CEAAF166358520D39DEDA814C8E.pdf; Supplier: LCSC; Tolerance: ±20%; Rated Voltage: 16V; φD: 6.3mm; L: 5.3mm; Lifetime @ Temp: 1000hrs@105℃; Operating Temperature: -45℃~+105℃
U1 U2 = CH334R: Supplier Part: C4154405; Manufacturer: WCH(南京沁恒); Supplier Footprint: QSOP-16-150mil; JLCPCB Part Class: 扩展库; Supplier: LCSC
USB1 = TYPE-C 16PIN 2MD(073): 连接器类型:Type-C;标准:-;公母:母;端口数量:1;触点数量:16P;安装方式:卧贴;额定电流 - 电源:5A;工作温度范围:-25℃~+85℃;; LCSC Part Name: Type-C 母 卧贴 带定位柱 不锈钢外壳 2次模顶; Supplier Part: C2765186; Manufacturer: SHOU HAN(首韩); Supplier Footprint: SMD; JLCPCB Part Class: 扩展库; Datasheet: https://atta.szlcsc.com/upload/public/pdf/source/20211123/39B17C16241EAC15C5E277BDA434118E.pdf; Supplier: LCSC; Connector Type: Type-C; Gender: 母; Number of Ports: 1; Number of Contacts: 16P; Mounting Style: 卧贴; Current Rating - Power (Max): 5A; Operating Temperature Range: -25℃~+85℃
USB2 USB3 = AF SS-JB17.6: 连接器类型:Type-A;标准:USB 2.0;公母:母;端口数量:2;触点数量:4P+4P;安装方式:弯插;额定电流 - 电源:1.5A;工作温度范围:-25℃~+85℃;; LCSC Part Name: Type-A 母 弯插; Supplier Part: C456021; Manufacturer: SHOU HAN(首韩); Supplier Footprint: 插件; JLCPCB Part Class: 扩展库; Datasheet: https://atta.szlcsc.com/upload/public/pdf/source/20191113/C456021_DAD2CFBF46E609FF6653446337360E6B.pdf; Supplier: LCSC; Connector Type: Type-A; Standard: USB 2.0; Gender: 母; Number of Ports: 2; Number of Contacts: 4P+4P; Mounting Style: 弯插; Current Rating - Power (Max): 1.5A; Operating Temperature Range: -25℃~+85℃
X1 X2 = X322512MSB4SI: 晶振类型:贴片晶振;频率:12MHz;常温频差:±10ppm;外接负载电容:20pF;频率稳定度(全温):±30ppm;; LCSC Part Name: 12MHz ±10ppm 20pF; Supplier Part: C9002; Manufacturer: YXC(扬兴晶振); Supplier Footprint: SMD3225-4P; JLCPCB Part Class: 基础库; Datasheet: https://atta.szlcsc.com/upload/public/pdf/source/20210329/C112971_1F611BDC486E193C1706F6D8EB5AA189.pdf; Supplier: LCSC; Crystal Type: 贴片晶振; Normal temperature Frequency Tolerance: ±10ppm; External load capacitor: 20pF; Frequency Stability(Full temperature range): ±30ppm; Operating Temperature: -40℃~+85℃

## Nets
3V3: C15.2 C16.2 C21.1 C22.1 C24.1 C35.1 C36.1 C41.2 CN1.2 CN2.1 CN3.1 L1.2 LED1.2(A) LED2.2(A) R4.1 R12.1 R23.2 R26.2 R29.1 R30.1 R31.2 SW2.2 U4.7(VCC) U4.10(V3) U7.5(VCC) U7.8(V3) U9.9(VDD) U10.6(VDD) U11.6(VDD) U12.2(VDD)
GND: C1.1 C2.2 C3.1 C4.1 C5.1 C6.1 C7.2 C8.2 C9.1 C10.2 C11.1 C12.1 C13.1 C14.1 C15.1 C16.1 C17.1 C19.2 C20.2 C21.2 C22.2 C23.1 C25.1 C26.1 C27.1 C28.1 C29.1 C30.1 C31.1 C32.1 C33.1 C34.1 C35.2 C36.2 C37.1 C38.1 C39.1 C40.1 C41.1 C44.2 C45.1 C48.2 C49.1 C50.1 C55.1 C60.1 C61.2 C62.2 C63.1 C64.2 C65.2 C66.2 C67.2 C68.2 C69.1 CN1.1 CN2.8 CN3.5 CN3.8 Q1.2(E) Q2.2(E) R1.2 R2.2 R5.2 R8.2 R14.1 RF1.1(GND) RF1.2(GND) RF1.3(GND) RF2.1(GND) RF2.2(GND) RF2.3(GND) SIM1.5(GND) SIM1.9(GND) SIM1.10(GND) SIM1.11(GND) SIM1.12(GND) SW1.2 SW1.3 SW1.4 SW2.3 SW2.4 U1.14(GND) U2.14(GND) U3.2(GND) U4.3(GND) U5.1(GND) U6.1(GND) U6.7(PWRKEY) U6.10(GND) U6.27(GND) U6.34(GND) U6.36(GND) U6.37(GND) U6.40(GND) U6.41(GND) U6.45(GND) U6.46(GND) U6.47(GND) U6.48(GND) U6.70(GND) U6.71(GND) U6.72(GND) U6.73(GND) U6.88(GND) U6.89(GND) U6.90(GND) U6.91(GND) U6.92(GND) U6.93(GND) U6.94(GND) U6.95(GND) U6.100(IO_1833_SEL) U7.3(GND) U8.1(GND) U8.9(EP) U9.8(GND) U9.13(EP) U10.7(GND) U11.7(GND) U12.5(GND) USB1.1(GND) USB1.12(GND) USB1.13(SHELL) USB1.14(SHELL) USB2.4(GND) USB2.8(GND) USB2.9(SHELL) USB2.10(SHELL) USB2.11(SHELL) USB2.12(SHELL) USB3.4(GND) USB3.8(GND) USB3.9(SHELL) USB3.10(SHELL) USB3.11(SHELL) USB3.12(SHELL) X1.2(GND) X1.4(GND) X2.2(GND) X2.4(GND)
VBAT: C19.1 C25.2 C26.2 C27.2 C28.2 C29.2 C30.2 L2.1 R7.1 U6.42(VBAT) U6.43(VBAT)
ADC0: CN3.6 U6.9(ADC0)
ADC1: CN3.7 U6.96(ADC1)
D-RXD: R35.1 U6.38(DBG_RXD)
D-TXD: R34.1 U6.39(DBG_TXD)
DM1: U1.7(DM1) U6.60(USB_DN)
DM2: U1.5(DM2) U4.2(UD-)
DM3: U1.3(DM3) U7.2(UD-)
DM4: U1.1(DM4) U2.10(DMU)
DM-UP: U1.10(DMU) USB1.5(DN2) USB1.7(DN1)
DP1: U1.8(DP1) U6.59(USB_DP)
DP2: U1.6(DP2) U4.1(UD+)
DP3: U1.4(DP3) U7.1(UD+)
DP4: U1.2(DP4) U2.11(DPU)
DP-UP: U1.11(DPU) USB1.6(DP1) USB1.8(DP2)
GPIO20: CN3.4 U6.102(AGPIOWU0)
GPIO21: CN3.2 U6.107(AGPIOWU1)
GPIO25: CN3.3 U6.106(AGPIO5)
HUB_DM1: U2.7(DM1) USB2.2(D-)
HUB_DM2: U2.5(DM2) USB2.6(D-)
HUB_DM3: U2.3(DM3) USB3.2(D-)
HUB_DM4: U2.1(DM4) USB3.6(D-)
HUB_DP1: U2.8(DP1) USB2.3(D+)
HUB_DP2: U2.6(DP2) USB2.7(D+)
HUB_DP3: U2.4(DP3) USB3.3(D+)
HUB_DP4: U2.2(DP4) USB3.7(D+)
I2C-SCL: CN1.3 R30.2 U6.67(I2C_SCL) U12.3(SCL)
I2C-SDA: CN1.4 R31.1 U6.66(I2C_SDA) U12.4(SDA)
I2S-BCK: U6.30(I2S_BCK) U9.1(SCLK)
I2S-DIN: U6.32(I2S_DIN)
I2S-DOUT: U6.33(I2S_DOUT) U9.12(SDATA)
I2S-LRCK: U6.31(I2S_LRCK) U9.2(LRCK)
I2S-MCLK: U6.26(I2S_MCLK) U9.3(CLKIN)
L-SPKN: C49.2 C52.1 R22.2
L-SPKP: C48.1 C51.1 R21.2
LCD-CLK: CN2.6 U6.53(LCD_CLK)
LCD-CS: CN2.5 U6.52(LCD_CS)
LCD-DOUT: CN2.3 U6.50(LCD_DOUT)
LCD-RS: CN2.4 U6.51(LCD_RS)
LCD-RST: CN2.2 U6.49(LCD_RST)
LCD-TE: CN2.7 U6.78(LCD_TE)
M-CTS: R36.2 U6.22(MAIN_CTS)
M-DCD: U6.21(MAIN_DCD)
M-DTR: U6.19(MAIN_DTR)
M-RI: U6.20(MAIN_RI)
M-RTS: R37.2 U6.23(MAIN_RTS)
M-RXD: R33.1 U6.17(MAIN_RXD)
M-TXD: R32.1 U6.18(MAIN_TXD)
NET_STATUS: R9.2 U6.16(NET_STATUS)
R-SPKN: C45.2 C57.1 R20.2
R-SPKP: C44.1 C56.1 R19.2
RESET_N: C23.2 R12.2 SW1.1 U6.15(RESET_N)
SIM1-CLK: C66.1 SIM1.3(CLK) U6.13(USIM_CLK)
SIM1-DATA: C67.1 SIM1.7(I/O) U6.11(USIM_DATA)
SIM1-DET: R29.2 SIM1.8(CD) U6.79(USIM_DET)
SIM1-RST: C65.1 SIM1.2(RST) U6.12(USIM_RST)
SIM1-VDD: C64.1 C68.1 SIM1.1(VCC) U6.14(USIM_VDD)
SIM2-CLK: U6.62(USIM2_CLK) U8.6(CLK)
SIM2-DAT: R17.1 R18.1 U6.64(USIM2_DAT) U8.3(IO)
SIM2-RST: U6.63(USIM2_RST) U8.7(RST#)
SIM2-VDD: C37.2 C38.2 R18.2 U6.65(USIM2_VDD) U8.8(VCC)
STATUS: R11.2 U6.25(STATUS)
USB-VBUS: C5.2 C6.2 C7.1 C8.1 C13.2 C14.2 C17.2 C20.1 R3.2 R6.2 U1.12(V5) U2.12(V5) U3.4(IN) U5.3(VIN) U6.61(VBUS) USB1.2(VBUS) USB1.11(VBUS) USB2.1(VCC) USB2.5(VCC) USB3.1(VCC) USB3.5(VCC)
USB_BOOT: C24.2 R14.2 SW2.1 U6.82(USB_BOOT)
$1N678: C3.2 C4.2 U1.13(VDD33)
$1N707: C1.2 U1.16(XI) X1.3(OSC2)
$1N726: R1.1 USB1.10(CC2)
$1N727: R2.1 USB1.4(CC1)
$1N731: C2.1 U1.15(XO) X1.1(OSC1)
$1N1108: C11.2 C12.2 U2.13(VDD33)
$1N1137: C9.2 U2.16(XI) X2.3(OSC2)
$1N1138: C10.1 U2.15(XO) X2.1(OSC1)
$2N388: L1.1 U3.3(LX)
$2N391: R3.1 U3.1(EN)
$2N396: R4.2 R5.1 U3.5(FB)
$2N960: C18.1 U5.6(BST)
$2N963: R6.1 U5.5(EN)
$2N966: C18.2 L2.2 U5.2(SW)
$2N969: R7.2 R8.1 U5.4(FB)
$3N1705: LED1.1(K) R10.2
$3N1706: Q1.3(C) R10.1
$3N1709: Q1.1(B) R9.1
$3N1711: LED2.1(K) R13.2
$3N1712: Q2.3(C) R13.1
$3N1715: Q2.1(B) R11.1
$3N1912: C33.2 R15.1 U6.35(LTE_ANT)
$3N2096: C31.2 R15.2 RF1.4(SIG)
$3N2500: C32.2 R16.1 U6.2(GNSS_ANT)
$3N4181: R17.2 U8.2(NC)
$3N9244: C69.2 L7.2 U6.8(GNSS_VCC)
$3N9261: C34.2 L7.1 R16.2 RF2.4(SIG)
$3N10691: R32.2 U4.9(RXD)
$3N10736: R33.2 U4.8(TXD)
$3N10788: R34.2 U7.7(RXD)
$3N10833: R35.2 U7.6(TXD)
$3N10879: R36.1 U4.4(RTS#)
$3N10924: R37.1 U4.5(CTS#)
$4N293: C39.2 U9.4(CAP1)
$4N296: C40.2 U9.5(CAP2)
$4N522: C42.1 U9.11(AOUTRP)
$4N527: C43.1 U9.10(AOUTRN)
$4N680: C42.2 R19.1
$4N683: C43.2 R20.1
$4N1144: C46.2 R21.1
$4N1146: C47.2 R22.1
$4N1170: C46.1 U9.7(AOUTLP)
$4N1181: C47.1 U9.6(AOUTLN)
$4N1348: R23.1 U10.1(CTRL)
$4N1407: C50.2 U10.2(BYPASS)
$4N1651: R24.2 U10.3(INP)
$4N1656: R25.2 U10.4(INN)
$4N1661: C51.2 R24.1
$4N1664: C52.2 R25.1
$4N1818: L3.1 U10.8(VOP)
$4N1821: L4.1 U10.5(VON)
$4N2066: C61.1 L3.2 SPK1.1(+)
$4N2077: C60.2 L4.2 SPK1.2(-)
$4N2586: R26.1 U11.1(CTRL)
$4N2591: C55.2 U11.2(BYPASS)
$4N2595: R27.2 U11.3(INP)
$4N2599: R28.2 U11.4(INN)
$4N2603: C56.2 R27.1
$4N2605: C57.2 R28.1
$4N2611: L5.1 U11.8(VOP)
$4N2613: L6.1 U11.5(VON)
$4N2619: C62.1 L5.2 SPK2.1(+)
$4N2624: C63.2 L6.2 SPK2.2(-)

Not connected (* = marked no-connect by the designer): SIM1 6(VPP)*; U1 9(RESET#/CDP)*; U2 9(RESET#/CDP)*; U4 6(TNOW/DTR#)*; U6 3(RESERVED)* 4(RESERVED)* 5(RESERVED)* 6(RESERVED)* 24(VDD_EXT)* 28(GNSS_TXD)* 29(GNSS_RXD)* 44(RESERVED)* 54(RESERVED)* 55(RESERVED)* 56(RESERVED)* 57(RESERVED)* 58(RESERVED)* 68(RESERVED)* 69(RESERVED)* 74(RESERVED)* 75(RESERVED)* 76(RESERVED)* 77(RESERVED)* 80(RESERVED)* 81(RESERVED)* 83(RESERVED)* 84(RESERVED)* 85(RESERVED)* 86(RESERVED)* 87(RESERVED)* 97(LDO_CTL)* 98(RESERVED)* 99(AGPIO3)* 101(WAKEUP0)* 103(RESERVED)* 104(RESERVED)* 105(RESERVED)* 108(1PPS)* 109(RESERVED)*; U7 4(RTS#)*; U8 4(NC)* 5(NC)*; U12 1(NC)* 6(NC)*; USB1 3(SBU2)* 9(SBU1)*

## Notes on the sheets
sheet 3
- 默认不贴
- 默认不焊0Ω电阻，根据厂商要求焊接
sheet 5
- 温湿度检测
